# EAGLE design mk312 (EAGLE 6.6.0)

## Sheet 1 of 5: PSU
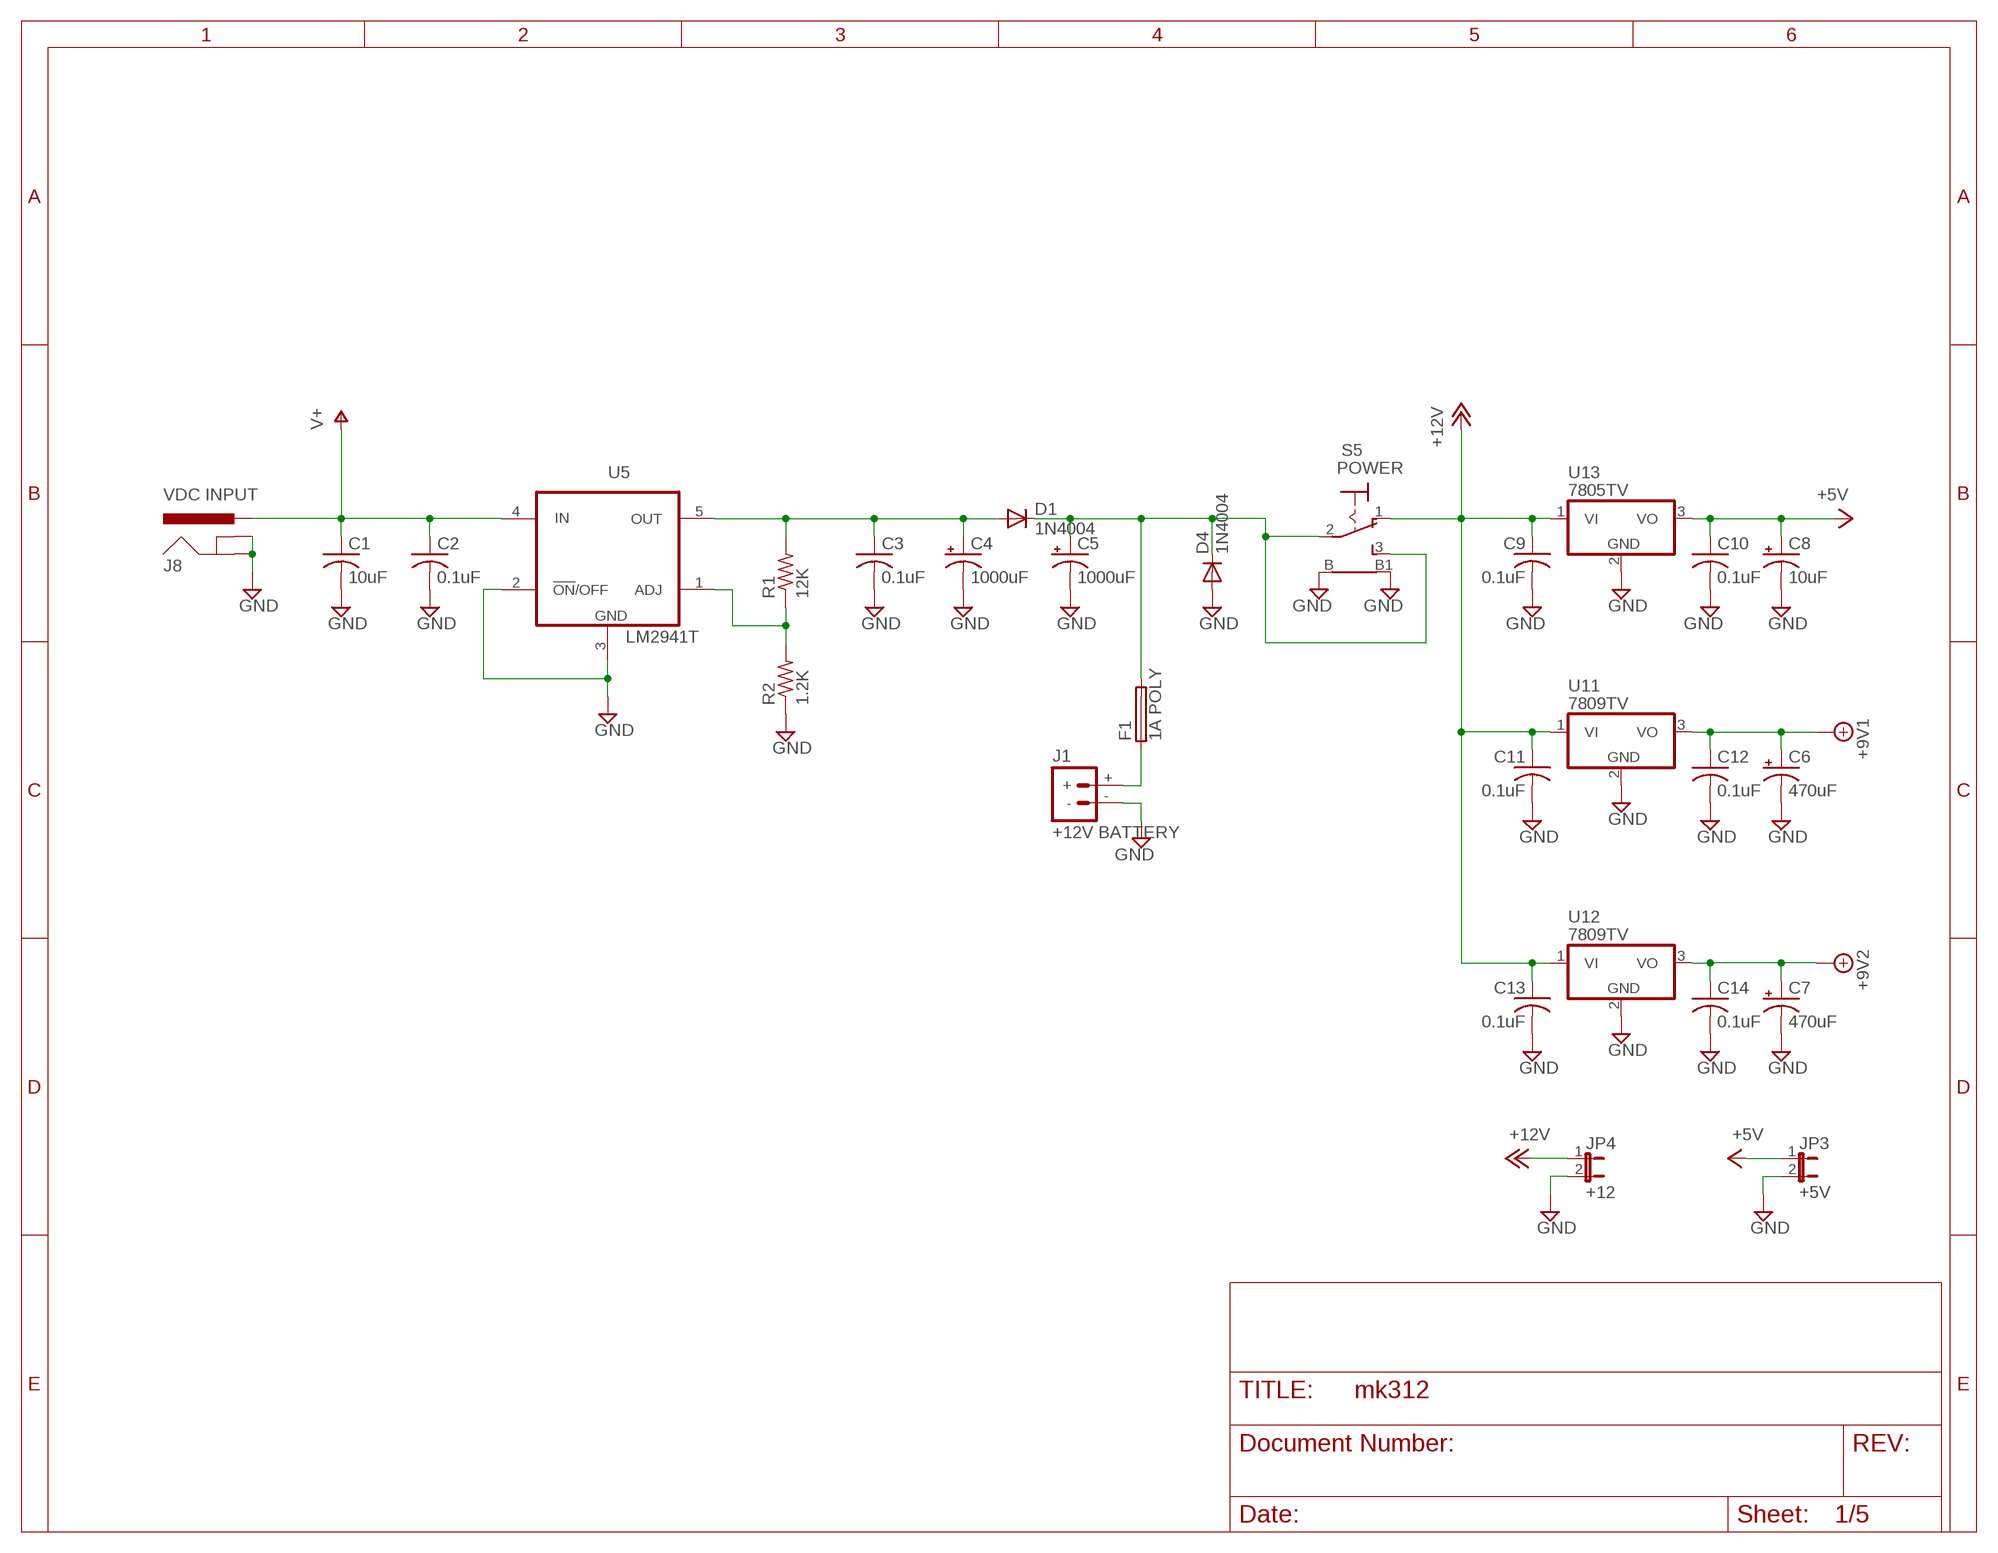
[diagram p0: schematic, sheet 1]

### Parts
C1  10uF  C-US050-024X044  [C050-024X044]
C2  0.1uF  C-US025-024X044  [C025-024X044]
C3  0.1uF  C-US025-024X044  [C025-024X044]
C4  1000uF  CPOL-USE5-10.5  [E5-10,5]
C5  1000uF  CPOL-USE5-10.5  [E5-10,5]
C6  470uF  CPOL-USE3.5-8  [E3,5-8]
C7  470uF  CPOL-USE3.5-8  [E3,5-8]
C8  10uF  CPOL-USE2.5-7  [E2,5-7]
C9  0.1uF  C-US025-024X044  [C025-024X044]
C10  0.1uF  C-US025-024X044  [C025-024X044]
C11  0.1uF  C-US025-024X044  [C025-024X044]
C12  0.1uF  C-US025-024X044  [C025-024X044]
C13  0.1uF  C-US025-024X044  [C025-024X044]
C14  0.1uF  C-US025-024X044  [C025-024X044]
D1  1N4004  [DO41-10]
D4  1N4004  [DO41-10]
F1  1A POLY  LITTLEFUSE  [LITTLEFUSE]
J1  +12V BATTERY  BATTERY_CONNDEANS  [DEANS]
J8  VDC INPUT  POWER_JACKSLT  [POWER_JACK_SLOT]
JP3  +5V  JP1E  [JP1]
JP4  +12  JP1E  [JP1]
R1  12K  R-US_0207/10  [0207/10]
R2  1.2K  R-US_0207/10  [0207/10]
S5  POWER  LPV-1  [LPV-1]
U5  LM2941T  [TO220-5]
U11  7809TV  7805TV  [TO220V]
U12  7809TV  7805TV  [TO220V]
U13  7805TV  [TO220V]

### Nets
+5V: C8.+ C10.1 JP3.1 U13.3(VO) ; also sheet 2,3,4,5
+8V: C6.+ C12.1 U11.3(VO) ; supply symbol labelled +9V1 ; also sheet 5
+9V: C7.+ C14.1 U12.3(VO) ; supply symbol labelled +9V2 ; also sheet 5
+12V: C9.1 C11.1 C13.1 JP4.1 S5.1(O) U11.1(VI) U12.1(VI) U13.1(VI) ; also sheet 2
GND: C1.2 C2.2 C3.2 C4.- C5.- C6.- C7.- C8.- C9.2 C10.2 C11.2 C12.2 C13.2 C14.2 D4.A J1.- J8.GND@1(GNDBREAK) J8.GND@2(GND) JP3.2 JP4.2 R2.1 S5.B S5.B1 U5.2(!ON!/OFF) U5.3(GND) U11.2(GND) U12.2(GND) U13.2(GND) ; also sheet 2,3,4,5
N$31: F1.1 J1.+
N$43: R1.1 R2.2 U5.1(ADJ)
N$45: C3.1 C4.+ D1.A R1.2 U5.5(OUT)
N$78: C5.+ D1.C D4.C F1.2 S5.2(P) S5.3(S)
V+: C1.1 C2.1 J8.PWR U5.4(IN) ; also sheet 2

## Sheet 2 of 5
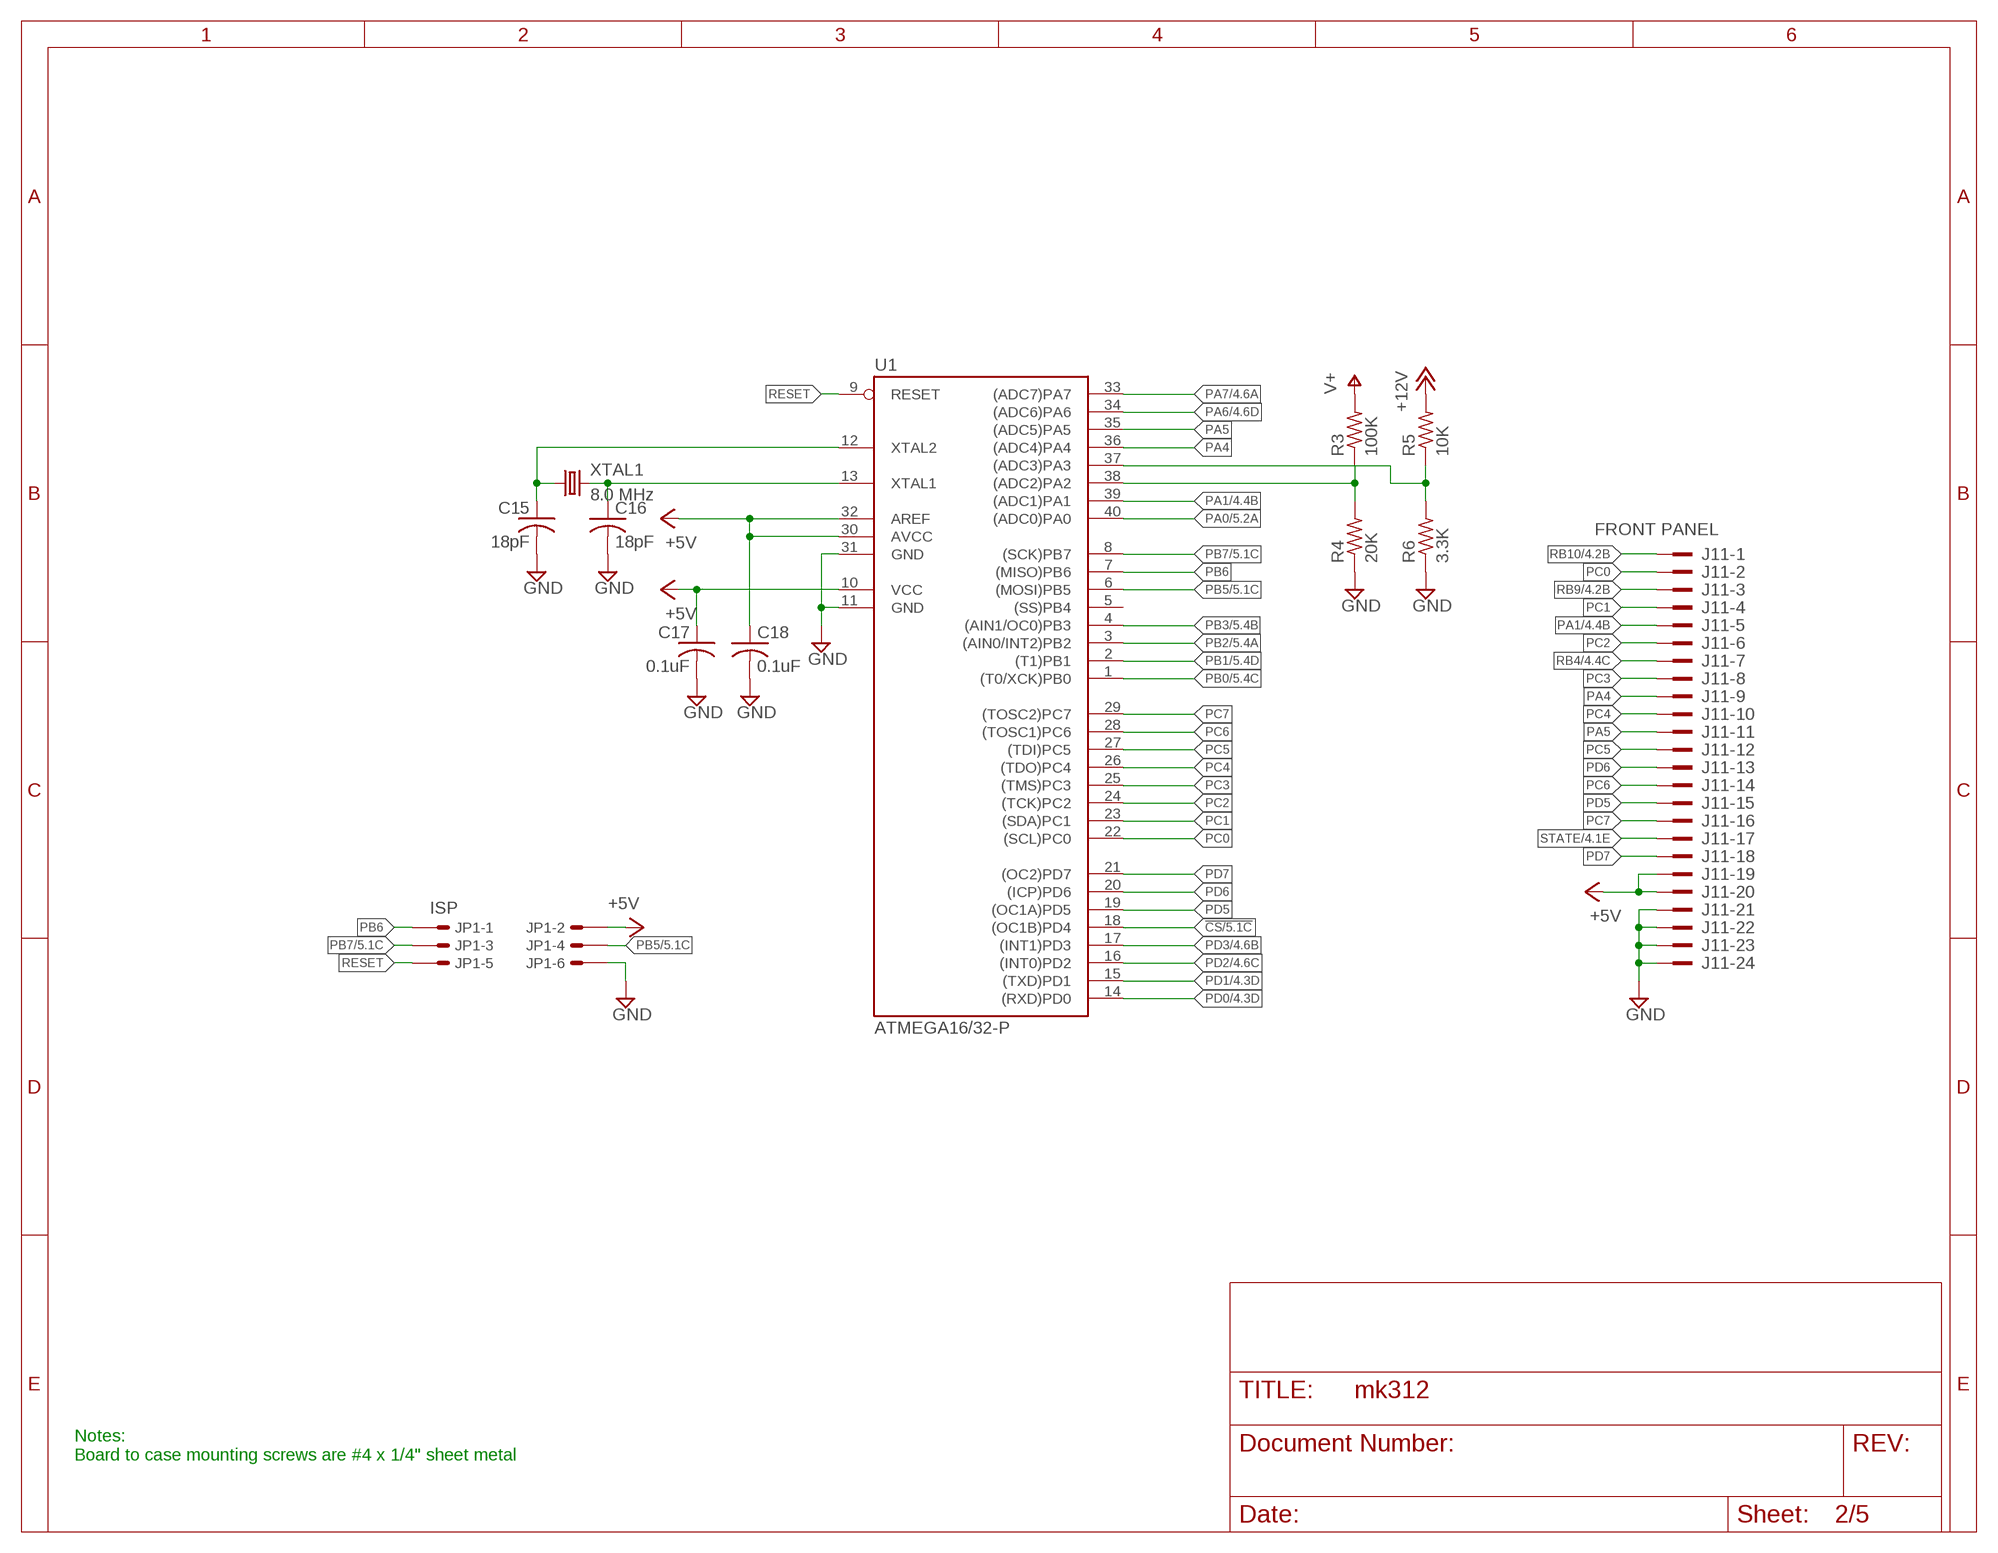
[diagram p1: schematic, sheet 2]

### Parts
C15  18pF  C-US025-024X044  [C025-024X044]
C16  18pF  C-US025-024X044  [C025-024X044]
C17  0.1uF  C-US025-024X044  [C025-024X044]
C18  0.1uF  C-US025-024X044  [C025-024X044]
J11  FRONT PANEL  2524-  [PAK100/2500-24]
JP1  ISP  057-006-1  [057-006-1]
R3  100K  R-US_0207/10  [0207/10]
R4  20K  R-US_0207/10  [0207/10]
R5  10K  R-US_0207/10  [0207/10]
R6  3.3K  R-US_0207/10  [0207/10]
U1  ATMEGA16/32-P  MEGA16-P  [DIL40]
XTAL1  8.0 MHz  CRYSTALHC49S  [HC49/S]

### Nets
!CS: U1.18((OC1B)PD4) ; also sheet 5
+5V: C17.1 C18.1 J11.19 J11.20 JP1.2 U1.10(VCC) U1.30(AVCC) U1.32(AREF) ; also sheet 1,3,4,5
+12V: R5.2 ; also sheet 1
GND: C15.2 C16.2 C17.2 C18.2 J11.21 J11.22 J11.23 J11.24 JP1.6 R4.1 R6.1 U1.11(GND) U1.31(GND) ; also sheet 1,3,4,5
N$2: R5.1 R6.2 U1.37((ADC3)PA3)
N$3: R3.1 R4.2 U1.38((ADC2)PA2)
N$17: C16.1 U1.13(XTAL1) XTAL1.2
N$32: C15.1 U1.12(XTAL2) XTAL1.1
PA0: U1.40((ADC0)PA0) ; also sheet 5
PA1: J11.5 U1.39((ADC1)PA1) ; also sheet 4
PA4: J11.9 U1.36((ADC4)PA4)
PA5: J11.11 U1.35((ADC5)PA5)
PA6: U1.34((ADC6)PA6) ; also sheet 4
PA7: U1.33((ADC7)PA7) ; also sheet 4
PB0: U1.1((T0/XCK)PB0) ; also sheet 5
PB1: U1.2((T1)PB1) ; also sheet 5
PB2: U1.3((AIN0/INT2)PB2) ; also sheet 5
PB3: U1.4((AIN1/OC0)PB3) ; also sheet 5
PB5: JP1.4 U1.6((MOSI)PB5) ; also sheet 5
PB6: JP1.1 U1.7((MISO)PB6)
PB7: JP1.3 U1.8((SCK)PB7) ; also sheet 5
PC0: J11.2 U1.22((SCL)PC0) ; also sheet 3
PC1: J11.4 U1.23((SDA)PC1) ; also sheet 3
PC2: J11.6 U1.24((TCK)PC2) ; also sheet 3
PC3: J11.8 U1.25((TMS)PC3) ; also sheet 3
PC4: J11.10 U1.26((TDO)PC4) ; also sheet 3
PC5: J11.12 U1.27((TDI)PC5) ; also sheet 3
PC6: J11.14 U1.28((TOSC1)PC6) ; also sheet 3
PC7: J11.16 U1.29((TOSC2)PC7) ; also sheet 3
PD0: U1.14((RXD)PD0) ; also sheet 4
PD1: U1.15((TXD)PD1) ; also sheet 4
PD2: U1.16((INT0)PD2) ; also sheet 4
PD3: U1.17((INT1)PD3) ; also sheet 4
PD5: J11.15 U1.19((OC1A)PD5) ; also sheet 3
PD6: J11.13 U1.20((ICP)PD6) ; also sheet 3
PD7: J11.18 U1.21((OC2)PD7) ; also sheet 3
RB4: J11.7 ; also sheet 4
RB9: J11.3 ; also sheet 4
RB10: J11.1 ; also sheet 4
RESET: JP1.5 U1.9(RESET)
STATE: J11.17 ; also sheet 4
V+: R3.2 ; also sheet 1
Unconnected: U1.5((SS)PB4)

### Notes on the sheet
- Notes:
  Board to case mounting screws are #4 x 1/4" sheet metal

## Sheet 3 of 5: Small PCB
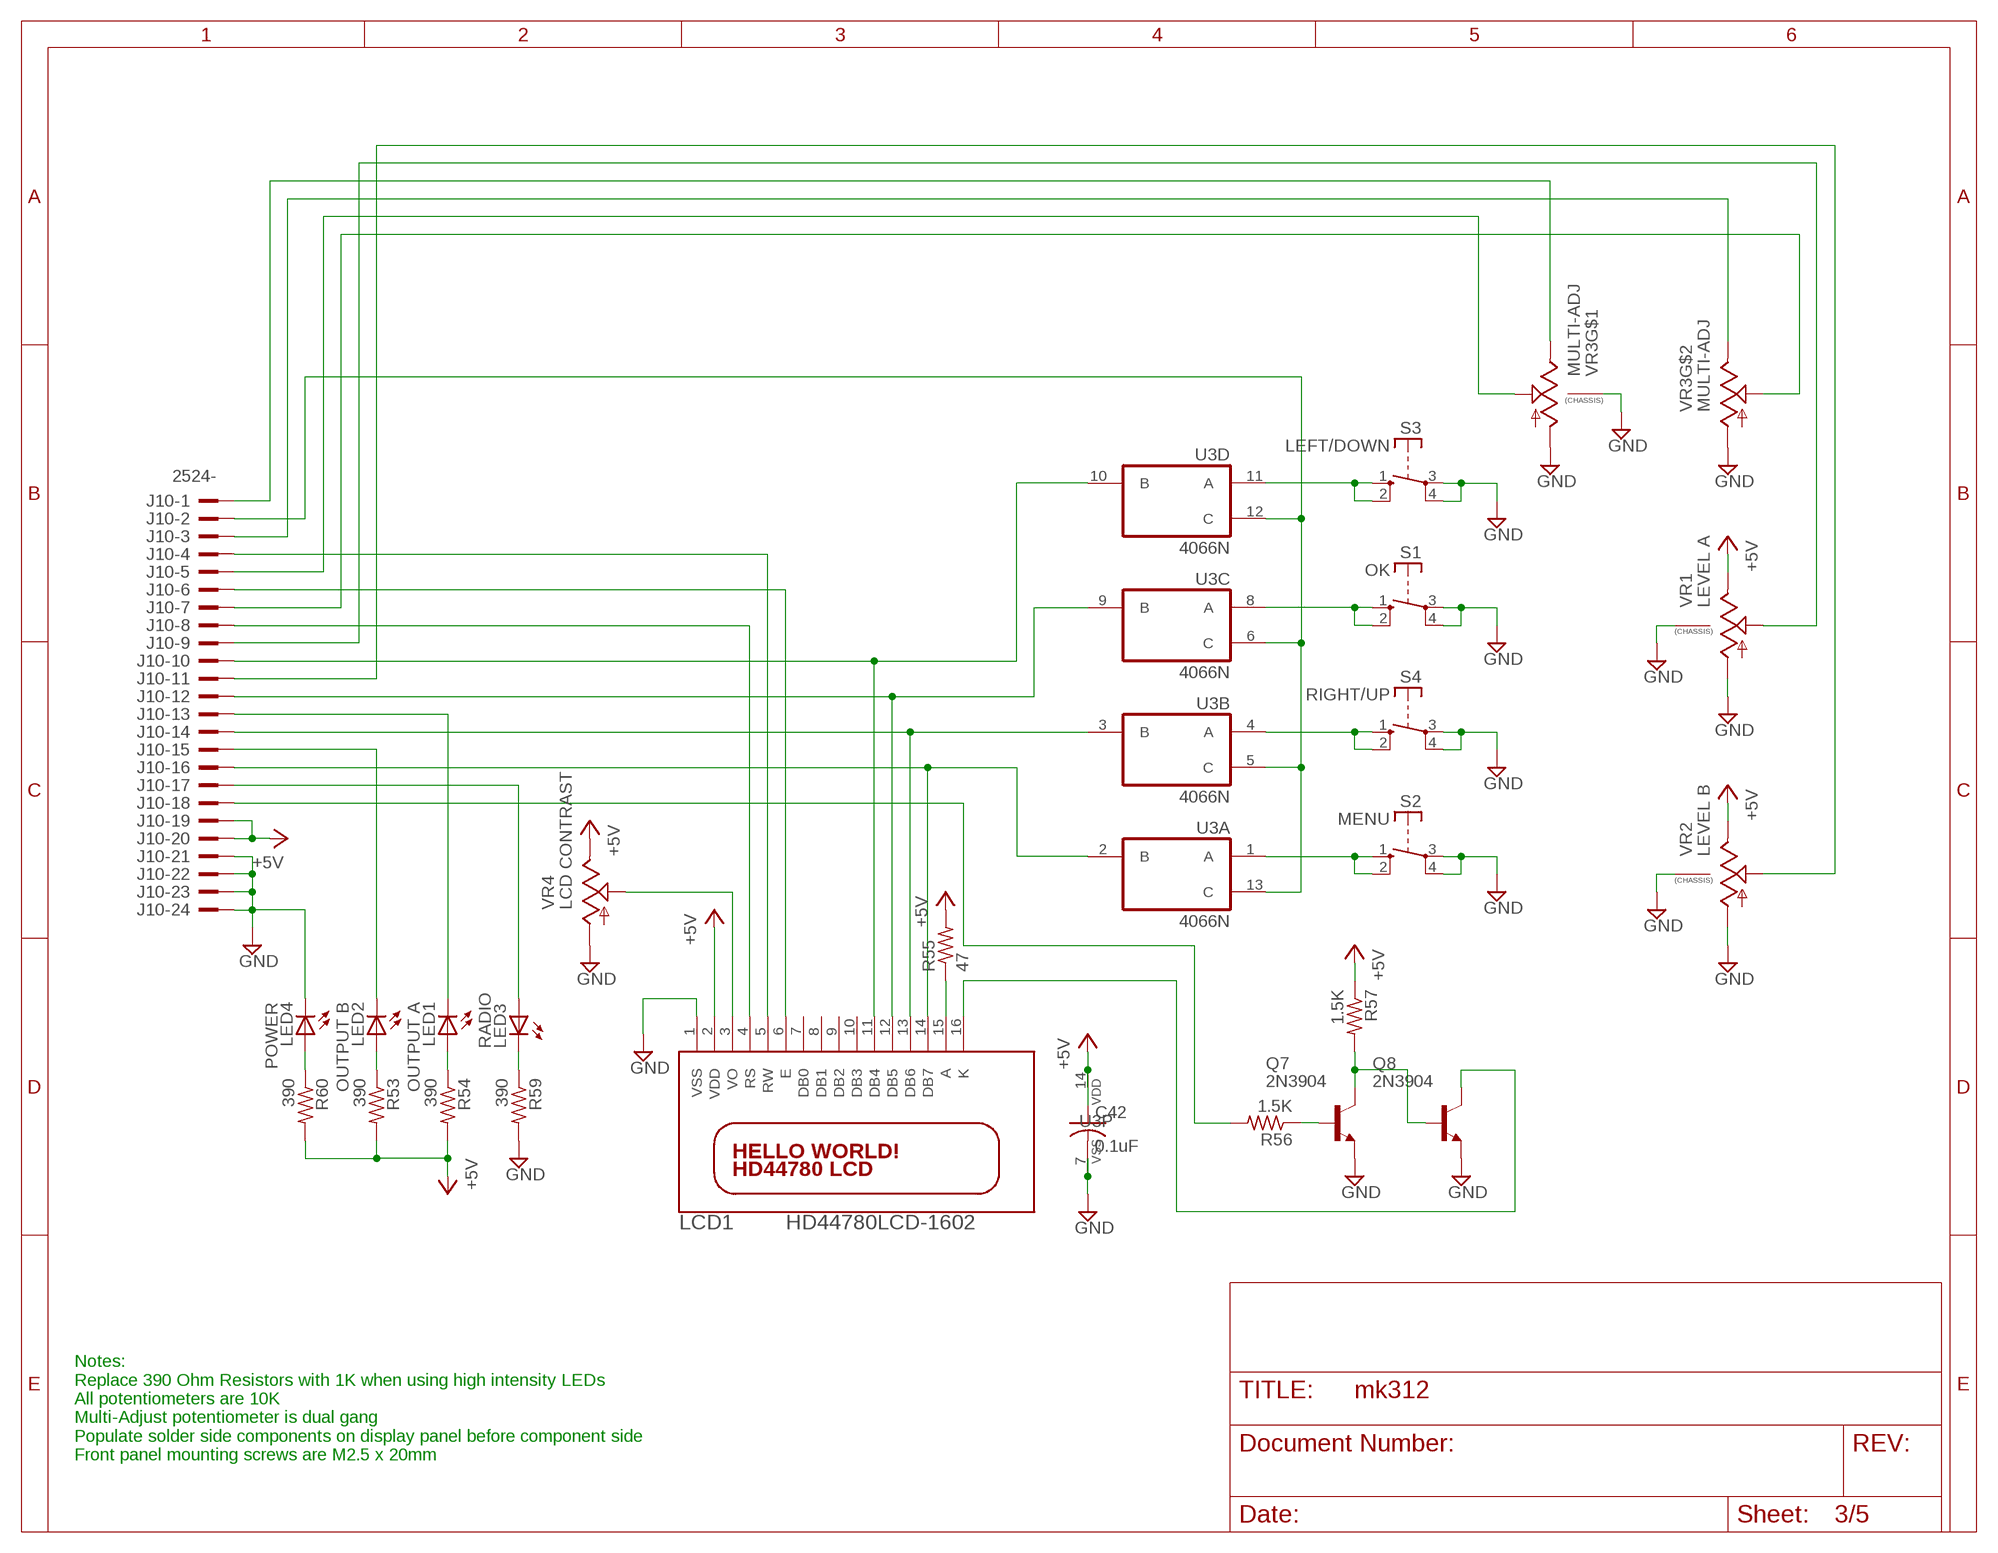
[diagram p2: schematic, sheet 3]

### Parts
C42  0.1uF  C-US025-024X044  [C025-024X044]
J10  2524-  [PAK100/2500-24]
LCD1  HD44780LCD-1602  [LCD1602]
LED1  OUTPUT A  LED5MM  [LED5MM]
LED2  OUTPUT B  LED5MM  [LED5MM]
LED3  RADIO  LED5MM  [LED5MM]
LED4  POWER  LED5MM  [LED5MM]
Q7  2N3904  [TO92]
Q8  2N3904  [TO92]
R53  390  R-US_0207/10  [0207/10]
R54  390  R-US_0207/10  [0207/10]
R55  47  R-US_0207/10  [0207/10]
R56  1.5K  R-US_0207/10  [0207/10]
R57  1.5K  R-US_0207/10  [0207/10]
R59  390  R-US_0207/10  [0207/10]
R60  390  R-US_0207/10  [0207/10]
S1  OK  DTE6K  [DTE6K]
S2  MENU  DTE6K  [DTE6K]
S3  LEFT/DOWN  DTE6K  [DTE6K]
S4  RIGHT/UP  DTE6K  [DTE6K]
U3  4066N  [DIL14]
VR1  LEVEL A  9MM_SNAP-IN_POT_CHASSIS  [9MM_SNAP-IN_POT]
VR2  LEVEL B  9MM_SNAP-IN_POT_CHASSIS  [9MM_SNAP-IN_POT]
VR3  MULTI-ADJ  ALPHA-9MM-DUALPOT  [DUAL_9MM_SNAP-IN_POT]
VR4  LCD CONTRAST  TRIM_US-B25P  [B25P]

### Nets
+5V: C42.1 J10.19 J10.20 LCD1.2(VDD) R53.2 R54.2 R55.2 R57.1 R60.2 U3.14(P:VDD) VR1.3(E) VR2.3(E) VR4.E ; also sheet 1,2,4,5
GND: C42.2 J10.21 J10.22 J10.23 J10.24 LCD1.1(VSS) LED4.K(C) Q7.3(E) Q8.3(E) R59.2 S1.3(P) S1.4(P) S2.3(P) S2.4(P) S3.3(P) S3.4(P) S4.3(P) S4.4(P) U3.7(P:VSS) VR1.1(A) VR1.CHASSIS2 VR2.1(A) VR2.CHASSIS2 VR3.1(A) VR3.1B(A) VR3.CHASSIS1 VR3.CHASSIS2 VR4.A ; also sheet 1,2,4,5
N$1: J10.7 VR3.2B(S)
N$4: S1.1(S) S1.2(S) U3.8(C:A)
N$5: S3.1(S) S3.2(S) U3.11(D:A)
N$7: S4.1(S) S4.2(S) U3.4(B:A)
N$10: J10.3 VR3.3B(E)
N$11: J10.9 VR1.2(S)
N$12: J10.11 VR2.2(S)
N$13: J10.1 VR3.3(E)
N$15: J10.5 VR3.2(S)
N$23: LED2.A R53.1
N$29: LED1.A R54.1
N$30: LCD1.3(VO) VR4.S
N$47: LCD1.15(A) R55.1
N$79: LED3.K(C) R59.1
N$80: S2.1(S) S2.2(S) U3.1(A:A)
N$81: LED4.A R60.1
N$82: Q7.2(B) R56.1
N$83: Q7.1(C) Q8.2(B) R57.2
N$84: LCD1.16(K) Q8.1(C)
N$86: J10.17 LED3.A
PC0: J10.2 U3.5(B:C) U3.6(C:C) U3.12(D:C) U3.13(A:C) ; also sheet 2
PC1: J10.4 LCD1.5(RW) ; also sheet 2
PC2: J10.6 LCD1.6(E) ; also sheet 2
PC3: J10.8 LCD1.4(RS) ; also sheet 2
PC4: J10.10 LCD1.11(DB4) U3.10(D:B) ; also sheet 2
PC5: J10.12 LCD1.12(DB5) U3.9(C:B) ; also sheet 2
PC6: J10.14 LCD1.13(DB6) U3.3(B:B) ; also sheet 2
PC7: J10.16 LCD1.14(DB7) U3.2(A:B) ; also sheet 2
PD5: J10.15 LED2.K(C) ; also sheet 2
PD6: J10.13 LED1.K(C) ; also sheet 2
PD7: J10.18 R56.2 ; also sheet 2
Unconnected: LCD1.7(DB0) LCD1.8(DB1) LCD1.9(DB2) LCD1.10(DB3)

### Notes on the sheet
- Notes:
  Replace 390 Ohm Resistors with 1K when using high intensity LEDs
  All potentiometers are 10K
  Multi-Adjust potentiometer is dual gang
  Populate solder side components on display panel before component side
  Front panel mounting screws are M2.5 x 20mm

## Sheet 4 of 5: Input stage
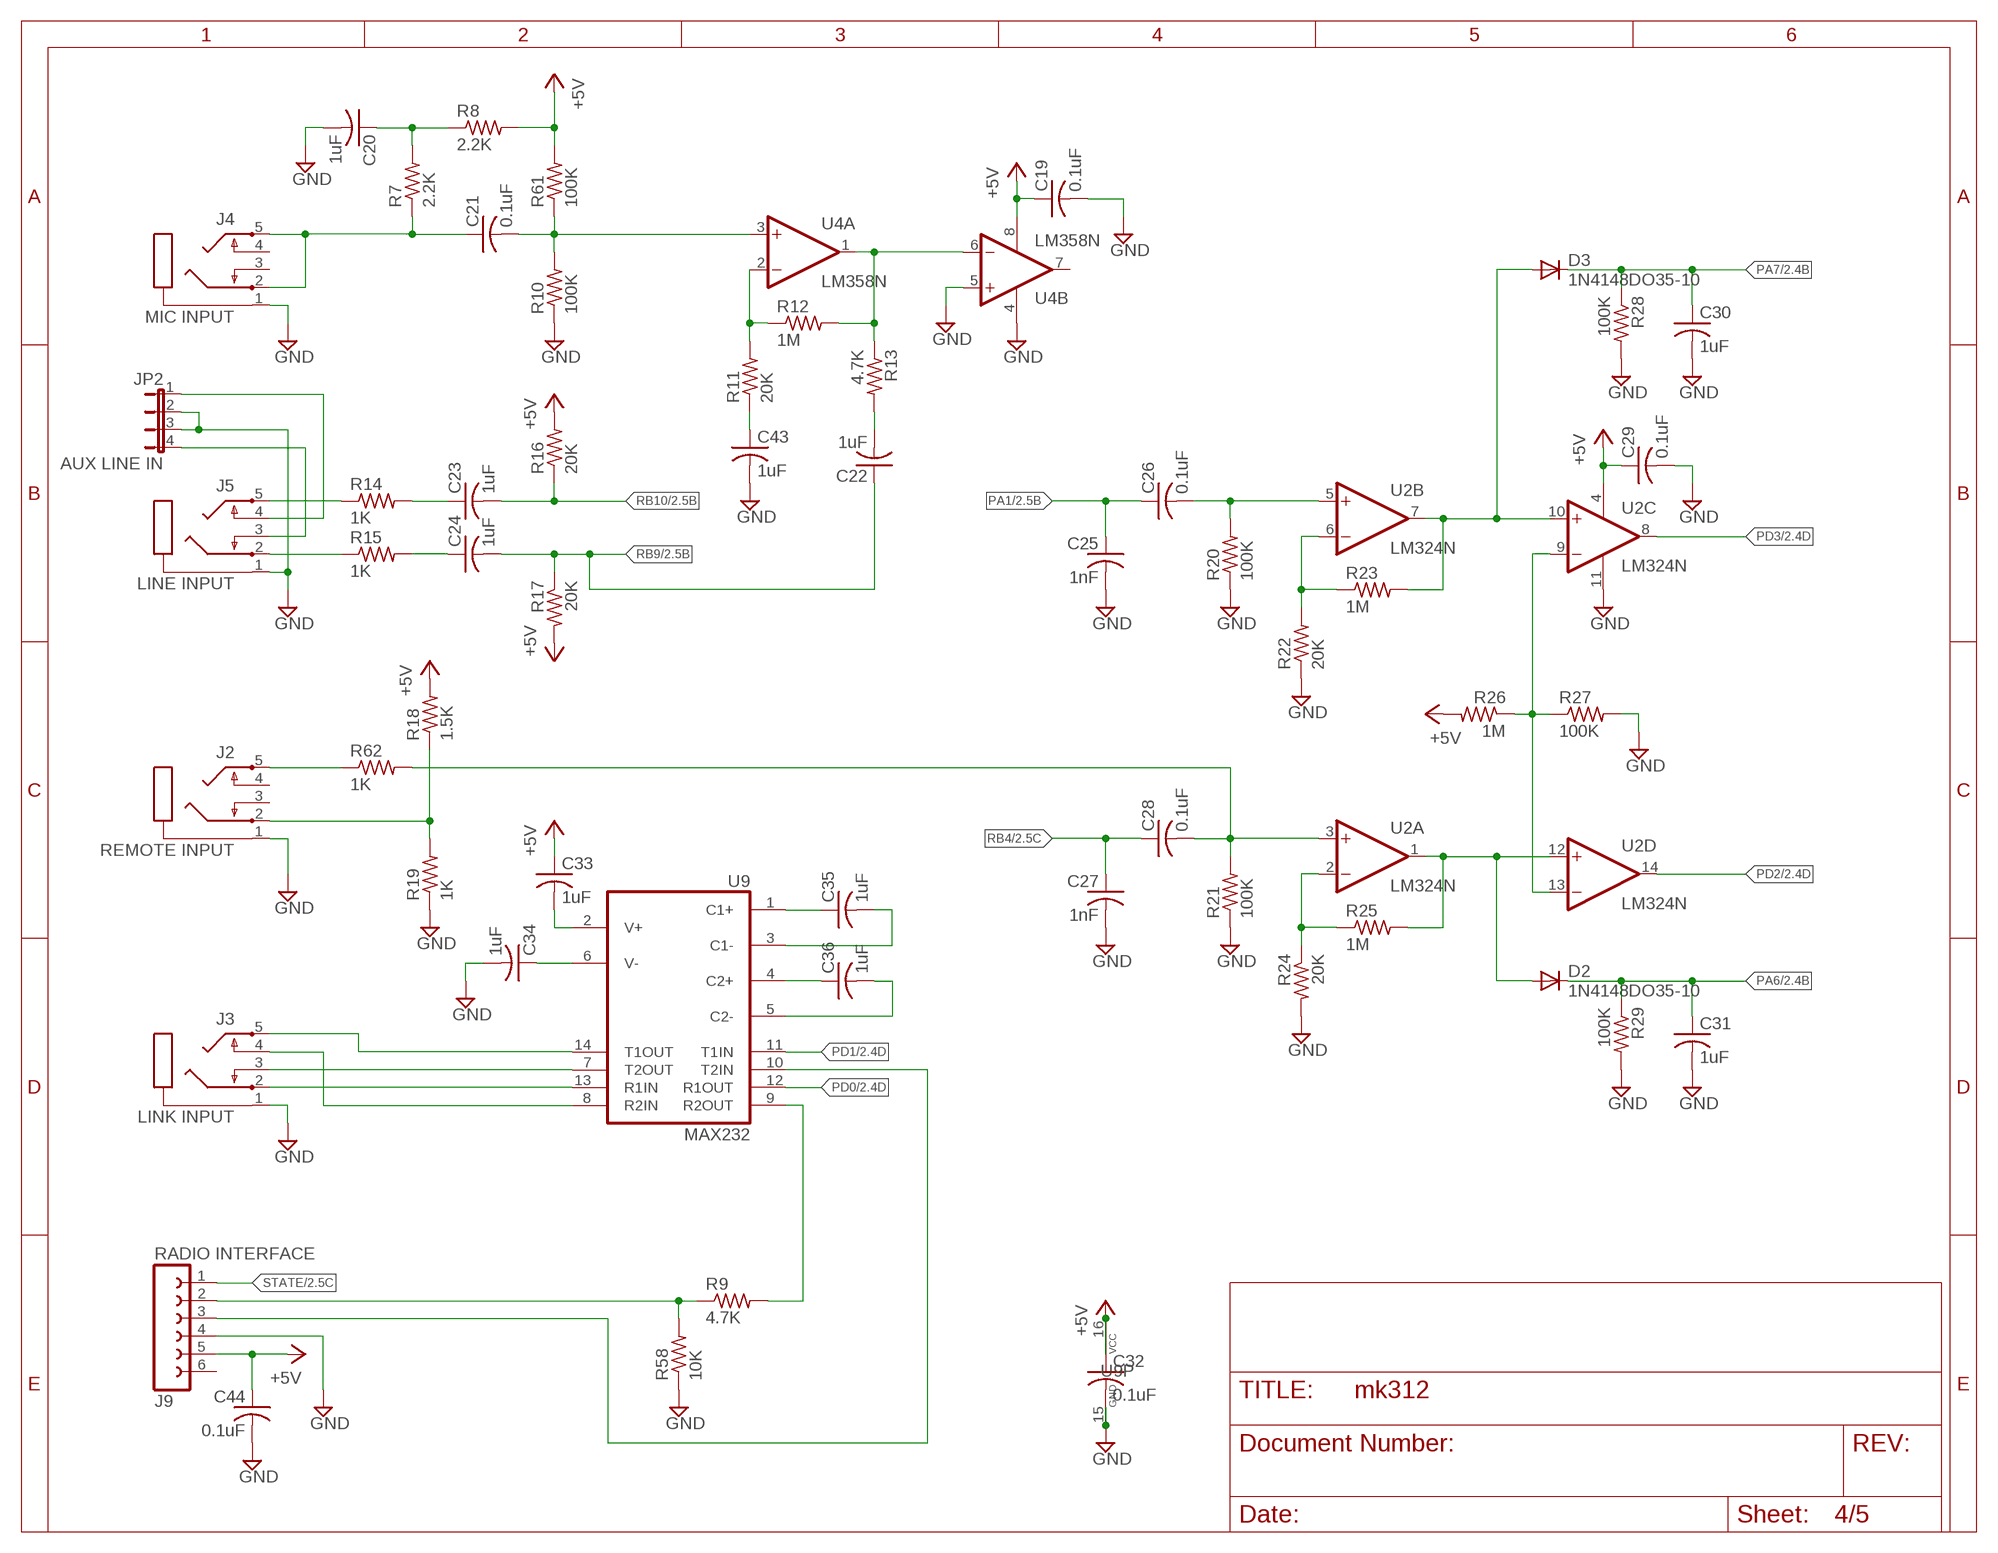
[diagram p3: schematic, sheet 4]

### Parts
C19  0.1uF  C-US025-024X044  [C025-024X044]
C20  1uF  C-US025-024X044  [C025-024X044]
C21  0.1uF  C-US025-024X044  [C025-024X044]
C22  1uF  C-US025-024X044  [C025-024X044]
C23  1uF  C-US025-024X044  [C025-024X044]
C24  1uF  C-US025-024X044  [C025-024X044]
C25  1nF  C-US025-024X044  [C025-024X044]
C26  0.1uF  C-US025-024X044  [C025-024X044]
C27  1nF  C-US025-024X044  [C025-024X044]
C28  0.1uF  C-US025-024X044  [C025-024X044]
C29  0.1uF  C-US025-024X044  [C025-024X044]
C30  1uF  C-US025-024X044  [C025-024X044]
C31  1uF  C-US025-024X044  [C025-024X044]
C32  0.1uF  C-US025-024X044  [C025-024X044]
C33  1uF  C-US025-024X044  [C025-024X044]
C34  1uF  C-US025-024X044  [C025-024X044]
C35  1uF  C-US025-024X044  [C025-024X044]
C36  1uF  C-US025-024X044  [C025-024X044]
C43  1uF  C-US025-024X044  [C025-024X044]
C44  0.1uF  C-US025-024X044  [C025-024X044]
D2  1N4148DO35-10  [DO35-10]
D3  1N4148DO35-10  [DO35-10]
J2  REMOTE INPUT  STEREOJACK  [STX3100]
J3  LINK INPUT  STEREOJACK  [STX3100]
J4  MIC INPUT  STEREOJACK  [STX3100]
J5  LINE INPUT  STEREOJACK  [STX3100]
J9  RADIO INTERFACE  FE06-1  [FE06]
JP2  AUX LINE IN  JP4E  [JP4]
R7  2.2K  R-US_0207/10  [0207/10]
R8  2.2K  R-US_0207/10  [0207/10]
R9  4.7K  R-US_0207/10  [0207/10]
R10  100K  R-US_0207/10  [0207/10]
R11  20K  R-US_0207/10  [0207/10]
R12  1M  R-US_0207/10  [0207/10]
R13  4.7K  R-US_0207/10  [0207/10]
R14  1K  R-US_0207/10  [0207/10]
R15  1K  R-US_0207/10  [0207/10]
R16  20K  R-US_0207/10  [0207/10]
R17  20K  R-US_0207/10  [0207/10]
R18  1.5K  R-US_0207/10  [0207/10]
R19  1K  R-US_0207/10  [0207/10]
R20  100K  R-US_0207/10  [0207/10]
R21  100K  R-US_0207/10  [0207/10]
R22  20K  R-US_0207/10  [0207/10]
R23  1M  R-US_0207/10  [0207/10]
R24  20K  R-US_0207/10  [0207/10]
R25  1M  R-US_0207/10  [0207/10]
R26  1M  R-US_0207/10  [0207/10]
R27  100K  R-US_0207/10  [0207/10]
R28  100K  R-US_0207/10  [0207/10]
R29  100K  R-US_0207/10  [0207/10]
R58  10K  R-US_0207/10  [0207/10]
R61  100K  R-US_0207/10  [0207/10]
R62  1K  R-US_0207/10  [0207/10]
U2  LM324N  [DIL14]
U4  LM358N  [DIL08]
U9  MAX232  [DIL16]

### Nets
+5V: C19.1 C29.1 C32.1 C33.1 C44.1 J9.5 R8.2 R16.2 R17.2 R18.2 R26.2 R61.2 U2.4(P:V+) U4.8(P:V+) U9.16(VCC) ; also sheet 1,2,3,5
GND: C19.2 C20.2 C25.2 C27.2 C29.2 C30.2 C31.2 C32.2 C34.2 C43.2 C44.2 J2.1 J3.1 J4.1 J5.1 J9.4 JP2.2 JP2.3 R10.1 R19.1 R20.1 R21.1 R22.1 R24.2 R27.2 R28.2 R29.2 R58.1 U2.11(P:V-) U4.4(P:V-) U4.5(B:+IN) U9.15(GND) ; also sheet 1,2,3,5
N$14: C28.2 R21.2 R62.2 U2.3(A:+IN)
N$33: R9.2 U9.9(R2OUT)
N$44: J3.5 U9.14(T1OUT)
N$46: J3.2 U9.13(R1IN)
N$49: C43.1 R11.1
N$50: J2.5 R62.1
N$52: C35.1 U9.1(C1+)
N$53: R24.1 R25.1 U2.2(A:-IN)
N$54: D2.A R25.2 U2.1(A:OUT) U2.12(D:+IN)
N$55: J5.2 R15.1
N$56: J5.5 R14.1
N$57: C23.1 R14.2
N$58: J2.2 R18.1 R19.2
N$59: J5.4 JP2.1
N$60: R22.2 R23.1 U2.6(B:-IN)
N$61: C35.2 U9.3(C1-)
N$62: R26.1 R27.1 U2.9(C:-IN) U2.13(D:-IN)
N$63: C26.2 R20.2 U2.5(B:+IN)
N$64: J5.3 JP2.4
N$65: C24.1 R15.2
N$66: C36.2 U9.5(C2-)
N$67: C36.1 U9.4(C2+)
N$68: J9.2 R9.1 R58.2
N$69: D3.A R23.2 U2.7(B:OUT) U2.10(C:+IN)
N$70: C34.1 U9.6(V-)
N$71: C21.1 J4.2 J4.5 R7.1
N$72: C20.1 R7.2 R8.1
N$73: C21.2 R10.2 R61.1 U4.3(A:+IN)
N$74: R11.2 R12.1 U4.2(A:-IN)
N$75: R12.2 R13.1 U4.1(A:OUT) U4.6(B:-IN)
N$76: C22.2 R13.2
N$77: C33.2 U9.2(V+)
N$87: J3.4 U9.8(R2IN)
N$88: J3.3 U9.7(T2OUT)
N$89: J9.3 U9.10(T2IN)
PA1: C25.1 C26.1 ; also sheet 2
PA6: C31.1 D2.C R29.1 ; also sheet 2
PA7: C30.1 D3.C R28.1 ; also sheet 2
PD0: U9.12(R1OUT) ; also sheet 2
PD1: U9.11(T1IN) ; also sheet 2
PD2: U2.14(D:OUT) ; also sheet 2
PD3: U2.8(C:OUT) ; also sheet 2
RB4: C27.1 C28.1 ; also sheet 2
RB9: C22.1 C24.2 R17.1 ; also sheet 2
RB10: C23.2 R16.1 ; also sheet 2
STATE: J9.1 ; also sheet 2
Unconnected: J2.3 J2.4 J4.3 J4.4 J9.6 U4.7(B:OUT)

## Sheet 5 of 5: Output stage
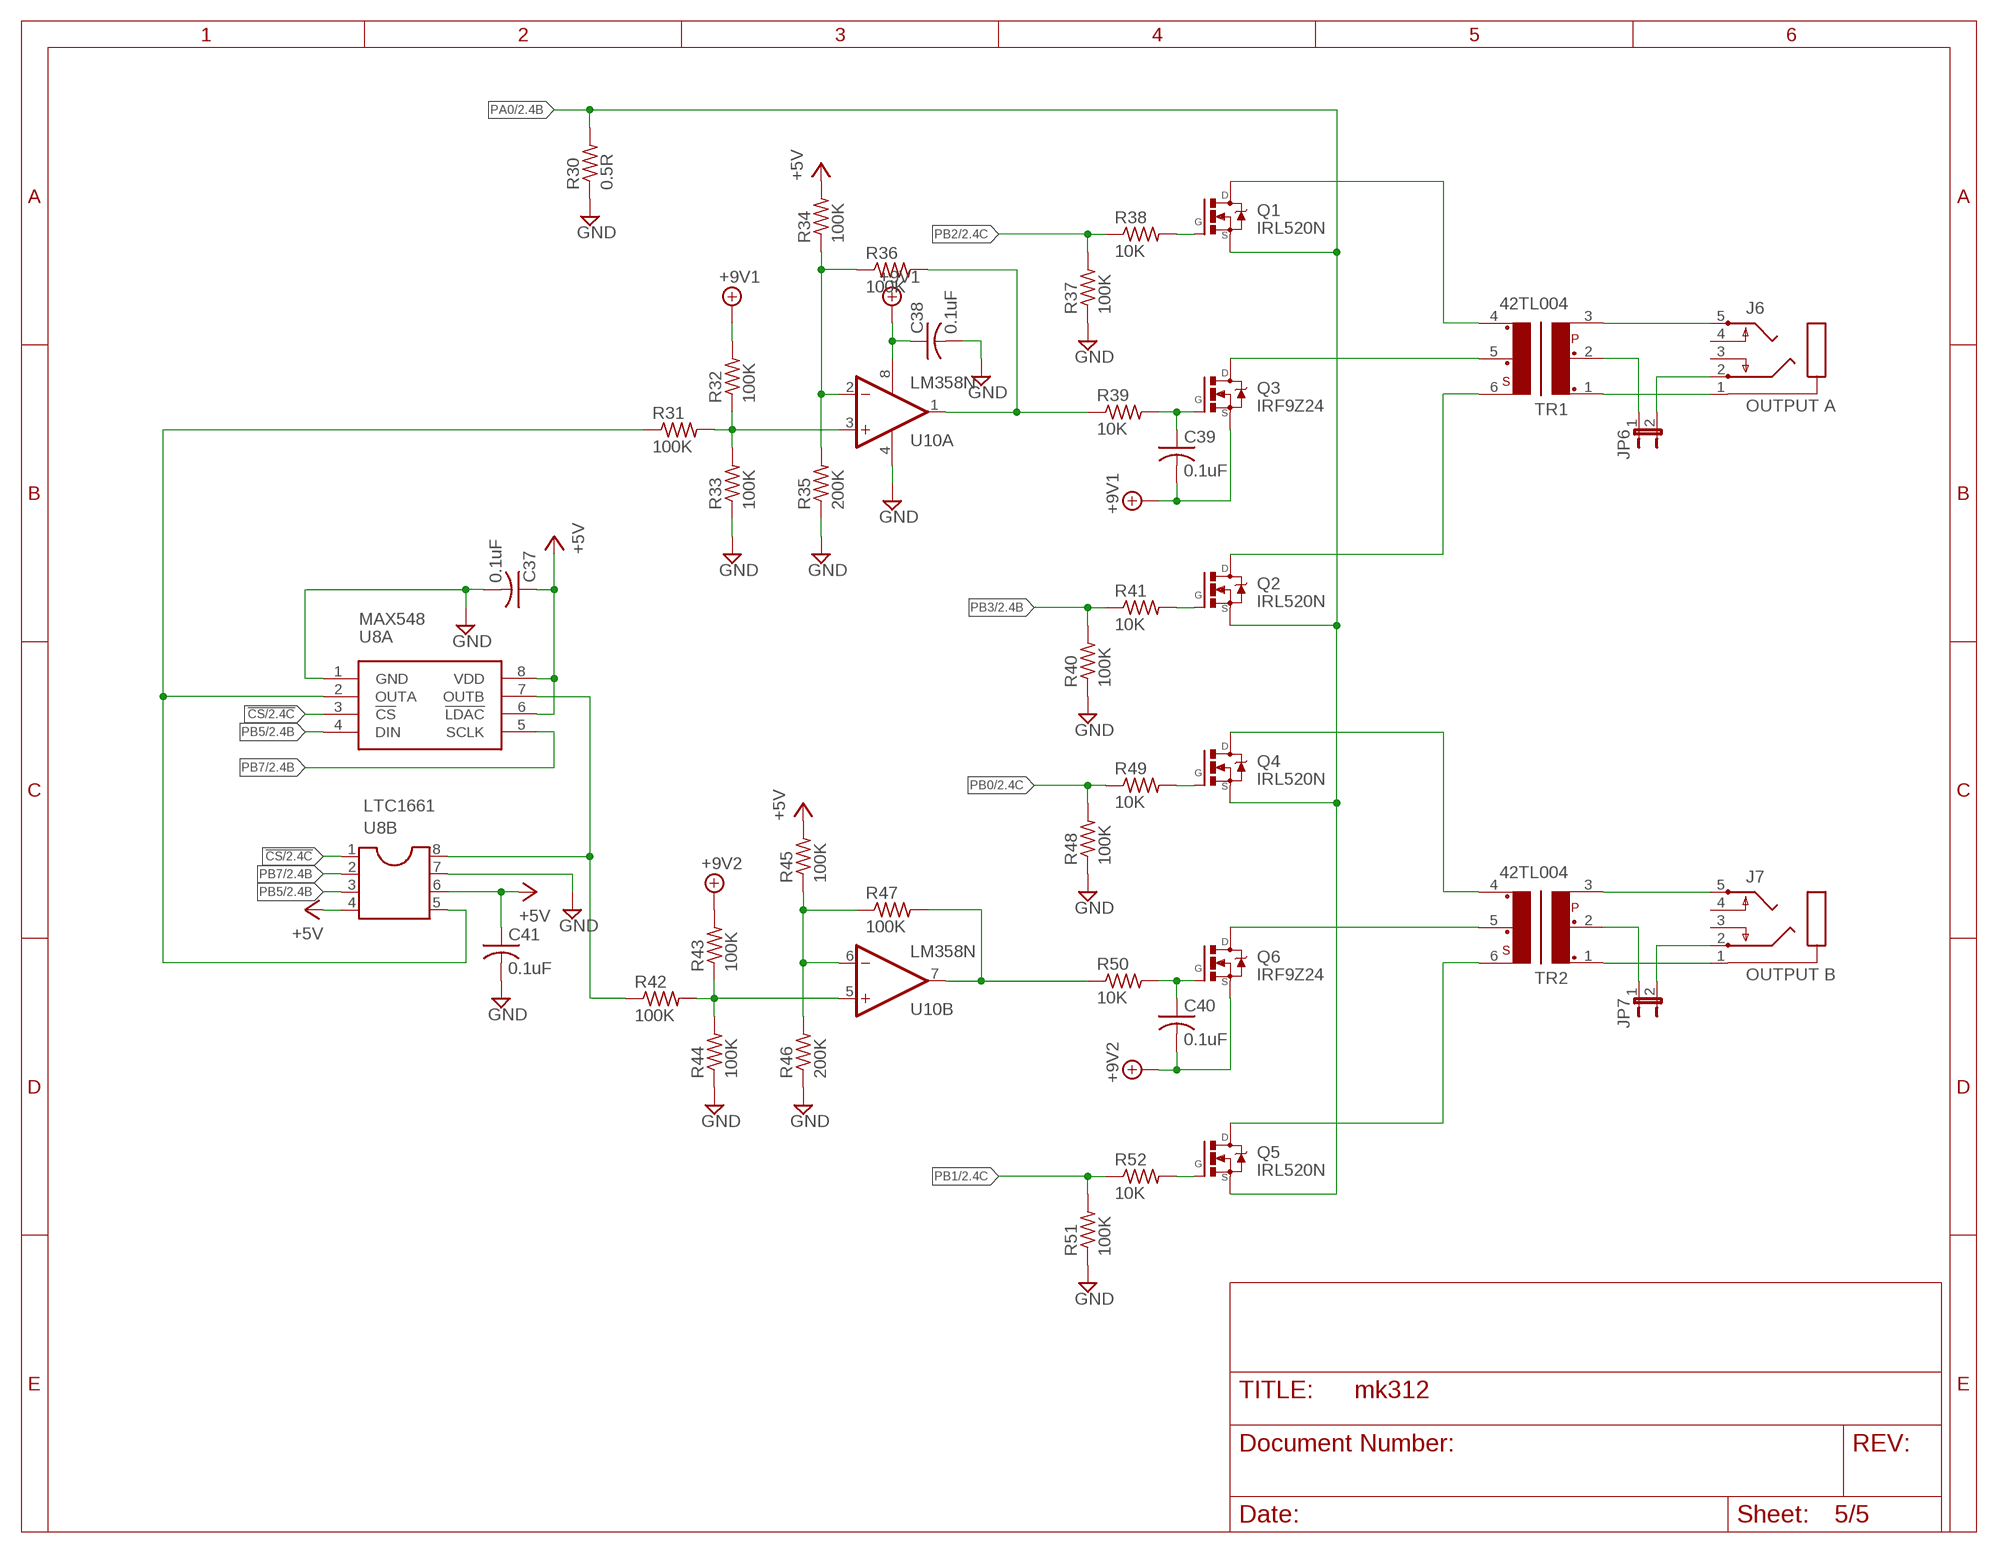
[diagram p4: schematic, sheet 5]

### Parts
C37  0.1uF  C-US025-024X044  [C025-024X044]
C38  0.1uF  C-US025-024X044  [C025-024X044]
C39  0.1uF  C-US025-024X044  [C025-024X044]
C40  0.1uF  C-US025-024X044  [C025-024X044]
C41  0.1uF  C-US025-024X044  [C025-024X044]
J6  OUTPUT A  STEREOJACK  [STX3100]
J7  OUTPUT B  STEREOJACK  [STX3100]
JP6  JP1E  [JP1]
JP7  JP1E  [JP1]
Q1  IRL520N  IRL530N-V  [TO220V]
Q2  IRL520N  IRL530N-V  [TO220V]
Q3  IRF9Z24  IRL530N-V  [TO220V]
Q4  IRL520N  IRL530N-V  [TO220V]
Q5  IRL520N  IRL530N-V  [TO220V]
Q6  IRF9Z24  IRL530N-V  [TO220V]
R30  0.5R  R-US_0309/12  [0309/12]
R31  100K  R-US_0207/10  [0207/10]
R32  100K  R-US_0207/10  [0207/10]
R33  100K  R-US_0207/10  [0207/10]
R34  100K  R-US_0207/10  [0207/10]
R35  200K  R-US_0207/10  [0207/10]
R36  100K  R-US_0207/10  [0207/10]
R37  100K  R-US_0207/10  [0207/10]
R38  10K  R-US_0207/10  [0207/10]
R39  10K  R-US_0207/10  [0207/10]
R40  100K  R-US_0207/10  [0207/10]
R41  10K  R-US_0207/10  [0207/10]
R42  100K  R-US_0207/10  [0207/10]
R43  100K  R-US_0207/10  [0207/10]
R44  100K  R-US_0207/10  [0207/10]
R45  100K  R-US_0207/10  [0207/10]
R46  200K  R-US_0207/10  [0207/10]
R47  100K  R-US_0207/10  [0207/10]
R48  100K  R-US_0207/10  [0207/10]
R49  10K  R-US_0207/10  [0207/10]
R50  10K  R-US_0207/10  [0207/10]
R51  100K  R-US_0207/10  [0207/10]
R52  10K  R-US_0207/10  [0207/10]
TR1  42TL004  42TL023  [42TL]
TR2  42TL004  42TL023  [42TL]
U8A  MAX548  [DIL08]
U8B  LTC1661  DIL8S  [SOCKET-08]
U10  LM358N  [DIL08]

### Nets
!CS: U8A.3(!CS) U8B.1 ; also sheet 2
+5V: C37.1 C41.1 R34.2 R45.2 U8A.6(!LDAC) U8A.8(VDD) U8B.4 U8B.6 ; also sheet 1,2,3,4
+8V: C38.1 C39.2 Q3.3(S) R32.2 U10.8(P:V+) ; supply symbol labelled +9V1 ; also sheet 1
+9V: C40.2 Q6.3(S) R43.2 ; supply symbol labelled +9V2 ; also sheet 1
GND: C37.2 C38.2 C41.2 R30.1 R33.1 R35.1 R37.1 R40.1 R44.1 R46.1 R48.1 R51.1 U8A.1(GND) U8B.7 U10.4(P:V-) ; also sheet 1,2,3,4
N$6: Q3.2(D) TR1.5
N$8: Q6.2(D) TR2.5
N$9: JP7.1 TR2.2
N$16: J6.1 TR1.1
N$18: Q1.1(G) R38.2
N$19: Q2.1(G) R41.2
N$20: J7.2 JP7.2
N$21: C39.1 Q3.1(G) R39.2
N$22: R31.2 R32.1 R33.2 U10.3(A:+IN)
N$24: Q4.1(G) R49.2
N$25: Q5.1(G) R52.2
N$26: J7.1 TR2.1
N$27: C40.1 Q6.1(G) R50.2
N$28: R42.2 R43.1 R44.2 U10.5(B:+IN)
N$34: Q1.2(D) TR1.4
N$35: J6.5 TR1.3
N$36: Q4.2(D) TR2.4
N$37: J7.5 TR2.3
N$38: Q5.2(D) TR2.6
N$39: Q2.2(D) TR1.6
N$40: R34.1 R35.2 R36.1 U10.2(A:-IN)
N$41: R45.1 R46.2 R47.1 U10.6(B:-IN)
N$42: R31.1 U8A.2(OUTA) U8B.5
N$48: J6.2 JP6.2
N$51: JP6.1 TR1.2
N$85: R42.1 U8A.7(OUTB) U8B.8
PA0: Q1.3(S) Q2.3(S) Q4.3(S) Q5.3(S) R30.2 ; also sheet 2
PB0: R48.2 R49.1 ; also sheet 2
PB1: R51.2 R52.1 ; also sheet 2
PB2: R37.2 R38.1 ; also sheet 2
PB3: R40.2 R41.1 ; also sheet 2
PB5: U8A.4(DIN) U8B.3 ; also sheet 2
PB7: U8A.5(SCLK) U8B.2 ; also sheet 2
PFET_A: R36.2 R39.1 U10.1(A:OUT)
PFET_B: R47.2 R50.1 U10.7(B:OUT)
Unconnected: J6.3 J6.4 J7.3 J7.4

## Library data of the parts
C1-C3 C9-C44 = rcl:C-US: CAPACITOR, American symbol
C4-C8 = rcl:CPOL-US: POLARIZED CAPACITOR, American symbol
D1 D4 = diode:1N4004: DIODE general purpose rectifier, 1 A
D2 D3 = diode:1N4148: DIODE high speed (Philips)
F1 = fuse:LITTLEFUSE: LITTLEFUSE Picofuse/slow Littlefuse; OC_FARNELL: unknown; OC_NEWARK: unknown
J1 = SparkFun-Connectors:BATTERY_CONN: Various footprints for battery connectors
J2-J7 = adafruit:STEREOJACK: MIC/HEADPHONE JACK Stereo jack with two switches. Kycon STX3100, CUI SJ1-3555NG and/or 4UCon 05544
J8 = SparkFun-Connectors:POWER_JACK: Power Jack This is the standard 5.5mm barrel jack for power. The PTH is the most common, proven, reliable, footprint. The Slot footprint only works if the mill layer is transmitted to the PCB fab house so be warned. Mating wall wart : TOL-00298 (and others); PROD_ID: PRT-00119
J9 = con-lsta:FE06-1: FEMALE HEADER; OC_FARNELL: unknown; OC_NEWARK: unknown
J10 J11 = con-3m:2524-: 3M (TM) Pak 100 4-Wall Header Source: 3M; OC_FARNELL: unknown; OC_NEWARK: unknown
JP1 = con-panduit:057-006-: CONNECTOR 6-pin series 057 contact pc board low profile headers; OC_FARNELL: unknown; OC_NEWARK: unknown
JP2 = jumper:JP4E: JUMPER
JP3 JP4 JP6 JP7 = jumper:JP1E: JUMPER
LCD1 = adafruit:HD44780LCD: HD44780 LCD Standard character type LCDs, available in sizes from 8x1 to 40x4!
LED1-LED4 = led:LED: LED OSRAM: - CHIPLED LG R971, LG N971, LY N971, LG Q971, LY Q971, LO R971, LY R971 LH N974, LH R974 LS Q976, LO Q976, LY Q976 LO Q996 - Hyper CHIPLED LW Q18S LB Q993, LB Q99A, LB R99A - SideLED LS A670, LO A670, LY A670, LG A670, LP A670 LB A673, LV A673, LT A673, LW A673 LH A674 LY A675 LS A676, LA A676, LO A676, LY A676, LW A676 LS A679, LY A679, LG A679 - Hyper Micro SIDELED® LS Y876, LA Y876, LO Y876, LY Y876 LT Y87S - SmartLED LW L88C, LW L88S LB L89C, LB L89S, LG L890 LS L89K, LO L89K, LY L89K LS L896, LA L896, LO L896, LY L896 - TOPLED LS T670, LO T670, LY T670, LG T670, LP T670 LSG T670, LSP T670, LSY T670, LOP T670, LYG T670 LG T671, LOG T671, LSG T671 LB T673, LV T673, LT T673, LW T673 LH T674 LS T676, LA T676, LO T676, LY T676, LB T676, LH T676, LSB T676, LW T676 LB T67C, LV T67C, LT T67C, LS T67K, LO T67K, LY T67K, LW E67C LS E67B, LA E67B, LO E67B, LY E67B, LB E67C, LV E67C, LT E67C LW T67C LS T679, LY T679, LG T679 LS T770, LO T770, LY T770, LG T770, LP T770 LB T773, LV T773, LT T773, LW T773 LH T774 LS E675, LA E675, LY E675, LS T675 LS T776, LA T776, LO T776, LY T776, LB T776 LHGB T686 LT T68C, LB T68C - Hyper Mini TOPLED® LB M676 - Mini TOPLED Santana® LG M470 LS M47K, LO M47K, LY M47K Source: http://www.osram.convergy.de LUXEON: - LUMILED® LXK2-PW12-R00, LXK2-PW12-S00, LXK2-PW14-U00, LXK2-PW14-V00 LXK2-PM12-R00, LXK2-PM12-S00, LXK2-PM14-U00 LXK2-PE12-Q00, LXK2-PE12-R00, LXK2-PE12-S00, LXK2-PE14-T00, LXK2-PE14-U00 LXK2-PB12-K00, LXK2-PB12-L00, LXK2-PB12-M00, LXK2-PB14-N00, LXK2-PB14-P00, LXK2-PB14-Q00 LXK2-PR12-L00, LXK2-PR12-M00, LXK2-PR14-Q00, LXK2-PR14-R00 LXK2-PD12-Q00, LXK2-PD12-R00, LXK2-PD12-S00 LXK2-PH12-R00, LXK2-PH12-S00 LXK2-PL12-P00, LXK2-PL12-Q00, LXK2-PL12-R00 Source: www.luxeon.com KINGBRIGHT: KA-3528ASYC Source: www.kingbright.com
Q1-Q6 = transistor-fet-1:IRL530: MOSFET 17A 22.7nC 100mOhm Logic Level
Q7 Q8 = transistor-neu-to92:2N3904: NPN TRANSISTOR
R1-R62 = rcl:R-US_: RESISTOR, American symbol
S1-S4 = switch-misc:DT: ITT SWITCH
S5 = switch:LPV-1: TOGGLE SWITCH
TR1 TR2 = trafo-xicon:42T?*: Xicon Micro-Mini EI-12 Audio Transformers 42TL/42TC/42TM Series Source: http://www.mouser.com//catalog/specsheets/164201.pdf http://www.mouser.com/catalog/specsheets/114225.pdf http://www.mouser.com/catalog/specsheets/164267.pdf; OC_FARNELL: unknown; OC_NEWARK: unknown
U1 = atmel:MEGA16-P: MICROCONTROLLER 16 Kbytes FLASH 1 kbytes SRAM 512 bytes EEPROM USART 8-channel 10 bit ADC Source: avr.lbr; MPN: ATMEGA16-16PU; OC_FARNELL: 9171142; OC_NEWARK: 01M6885
U2 = linear:LM324: OP AMP
U3 = 40xx:4066: Quad bilateral ANALOG SWITCH
U4 U10 = linear:LM358: OP AMP also LM158; LM258; LM2904 Source: http://cache.national.com/ds/LM/LM158.pdf
U5 = national-semi:LM2941: LDO REGULATOR
U8A = JAEB:MAX548
U8B = ic-package:DIL8: Dual In Line / Socket
U9 = maxim:MAX232: RS232 TRANSCEIVER; MF: MAXIM; MPN: MAX232ACPE+; OC_FARNELL: 9723773; OC_NEWARK: 68K4544
U11-U13 = linear:78*: Positive VOLTAGE REGULATOR Source: http://cache.national.com/ds/LM/LM78L05.pdf http://www.fairchildsemi.com/ds/LM/LM7805.pdf
VR1 VR2 = MusicThingModular:9MM_SNAP-IN_POT_CHASSIS: 9mm vertical snap-in pot, Alpha / Panasonic style, with a connection to the metal chassis for grounding
VR3 = MusicThingModular:ALPHA-9MM-DUALPOT: 9mm vertical snap-in pot, Alpha / Panasonic style, with a connection to the metal chassis for grounding
VR4 = pot:TRIM_US-: POTENTIOMETER
XTAL1 = crystal:CRYSTAL: CRYSTAL; OC_FARNELL: 1667008; OC_NEWARK: unknown

## Net classes
0 default: width 0.4 mm
1 signal: width 0.254 mm
2 pwr: width 2 mm

## Board
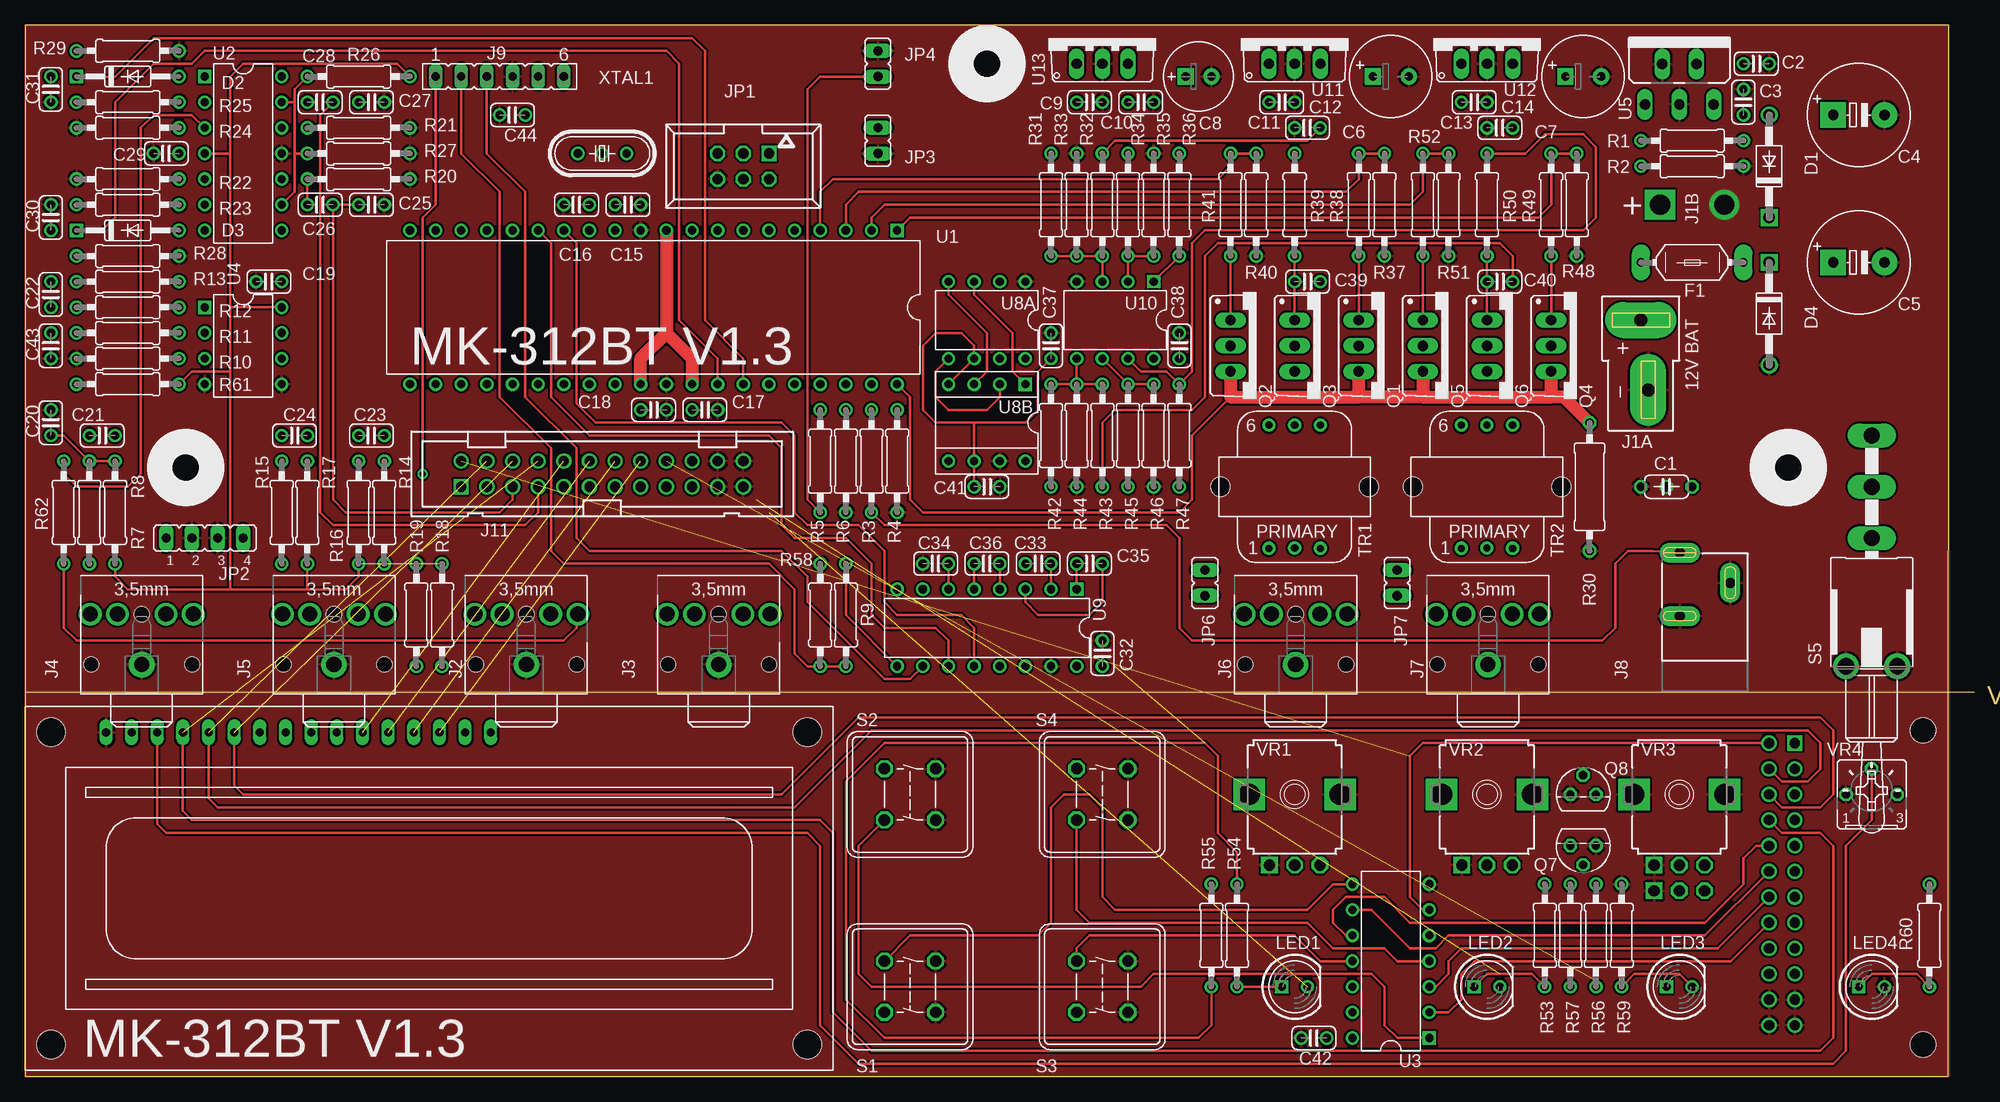
[diagram p5: board, top side]
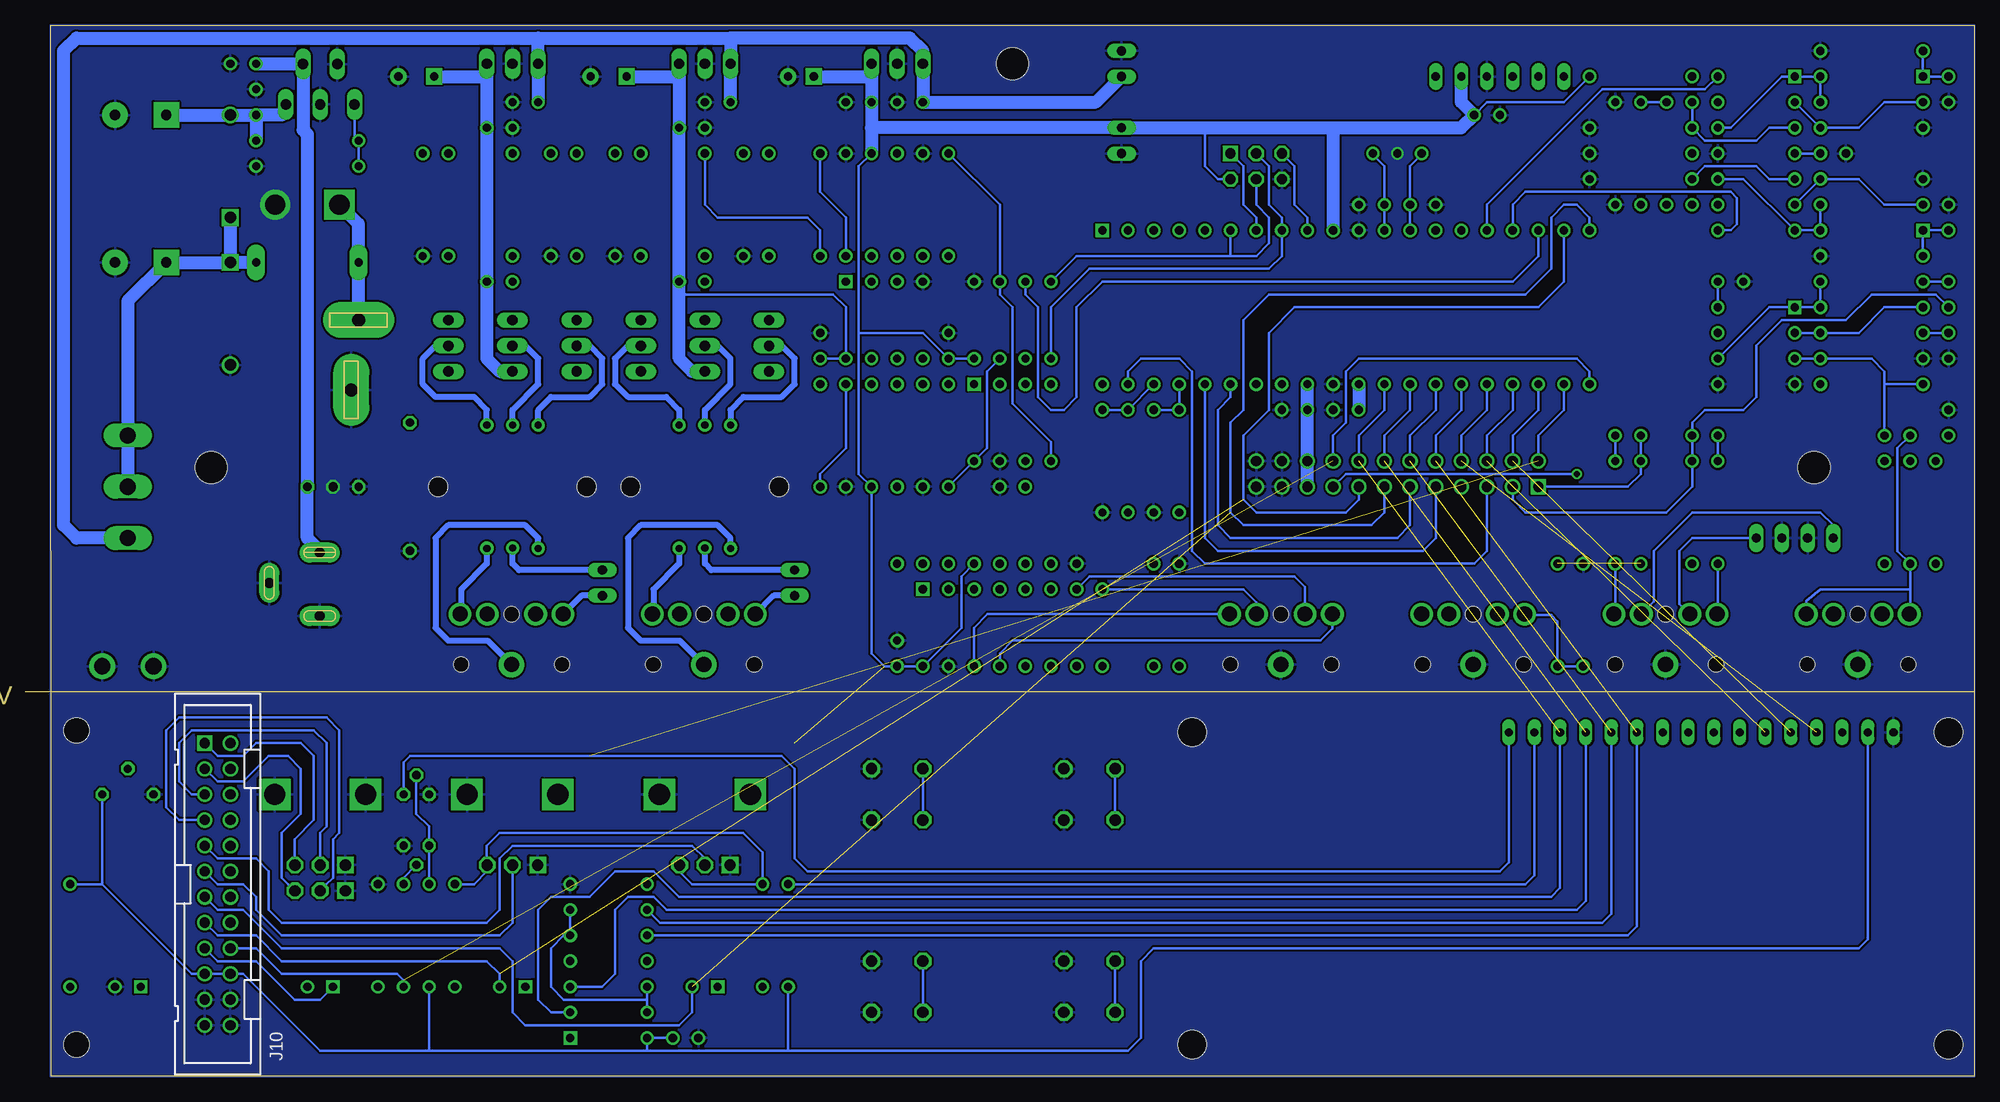
[diagram p6: board, bottom side, seen from below]

Size 193.04 x 104.14 mm. Coordinates in mm from the lower left corner, seen from the top.
Outline: 0,38.1 0,104.14 190.5,104.14 190.48,0 0,0 0,38.1
Outline: 0,38.1 193.04,38.1
Copper layers (1*16): Top 0.035mm / dielectric 1.5mm / Bottom 0.035mm
Design rules "default *": minimum track width 10mil, minimum drill 24mil, track to track 8mil, track to pad 8mil, pad to pad 8mil, via to via 8mil, smd to smd 8mil, copper to edge 0mil, drill to drill 8mil, minimum pad ring 10mil, minimum via ring 8mil, stop-mask expansion 4mil, vias tented up to drill 0mil, thermal gap 10mil
Holes 3.2 mm at 15.88,60.33 174.62,60.33 95.25,100.33
Holes 2.5 mm at 187.96,34.29 187.96,3.17

### Footprints (pad centres in the part's own frame; a part is rotated, then mirrored left to right if it is on the bottom)
C050-024X044 = drill 0.813 octagon: 1 -2.54,0; 2 2.54,0
C025-024X044 = drill 0.813: 1 -1.27,0; 2 1.27,0
E5-10,5 = drill 1.016 pad 2.54 square: + -2.54,0 | drill 1.016 pad 2.54: - 2.54,0
E3,5-8 = drill 0.813 pad 1.6 square: + -1.778,0 | drill 0.813 pad 1.6: - 1.778,0
E2,5-7 = drill 0.813 pad 1.6 square: + -1.27,0 | drill 0.813 pad 1.6: - 1.27,0
DO41-10 = drill 1.118: A 5.08,0 | drill 1.118 square: C -5.08,0
DO35-10 = drill 0.813: A 5.08,0 | drill 0.813 square: C -5.08,0
LITTLEFUSE = drill 0.813 pad 1.778 long: 1 -5.08,0; 2 5.08,0
DEANS = drill 1.27 pad 3.556 long: + 0,0; - 0.737,-6.921
STX3100 = drill 1.5 pad 2.54: 1 2.7,-0.1 | drill 1.5: 2 7.7,5; 3 7.7,2.3; 4 7.7,-2.5; 5 7.7,-5.2 | hole 1.5: 2.7,4.9; 2.7,-5.1; 7.7,-0.1
POWER_JACK_SLOT = drill 1 pad 2 long: GND@1 2.58,7.5; GND@2 7.58,10.8; PWR 2.58,13.8
FE06 = drill 0.813 long: 1 -6.35,0; 2 -3.81,0; 3 -1.27,0; 4 1.27,0; 5 3.81,0; 6 6.35,0
PAK100/2500-24 = drill 1 pad 1.422 square: 1 -13.97,-1.27 | drill 1 pad 1.422: 2 -13.97,1.27; 3 -11.43,-1.27; 4 -11.43,1.27; 5 -8.89,-1.27; 6 -8.89,1.27; 7 -6.35,-1.27; 8 -6.35,1.27; 9 -3.81,-1.27; 10 -3.81,1.27; 11 -1.27,-1.27; 12 -1.27,1.27; 13 1.27,-1.27; 14 1.27,1.27; 15 3.81,-1.27; 16 3.81,1.27; 17 6.35,-1.27; 18 6.35,1.27; 19 8.89,-1.27; 20 8.89,1.27; 21 11.43,-1.27; 22 11.43,1.27; 23 13.97,-1.27; 24 13.97,1.27
057-006-1 = drill 1 square: 1 -2.54,-1.27 | drill 1 octagon: 2 -2.54,1.27; 3 0,-1.27; 4 0,1.27; 5 2.54,-1.27; 6 2.54,1.27
JP4 = drill 0.914 long: 1 -3.81,0; 2 -1.27,0; 3 1.27,0; 4 3.81,0
JP1 = drill 0.914 long: 1 0,-1.27; 2 0,1.27
LCD1602 = drill 0.8 long: 1 8,33.46; 2 10.54,33.46; 3 13.08,33.46; 4 15.62,33.46; 5 18.16,33.46; 6 20.7,33.46; 7 23.24,33.46; 8 25.78,33.46; 9 28.32,33.46; 10 30.86,33.46; 11 33.4,33.46; 12 35.94,33.46; 13 38.48,33.46; 14 41.02,33.46; 15 43.56,33.46; 16 46.1,33.46 | hole 2.8: 2.54,2.54; 2.54,33.46; 77.46,33.46; 77.46,2.54
LED5MM = drill 0.813 square: A -1.27,0 | drill 0.813: K 1.27,0
TO220V = drill 1.016 long: 1 -2.54,-2.54; 2 0,-2.54; 3 2.54,-2.54
TO92 = drill 0.813 octagon: 1 1.27,0; 2 0,1.905; 3 -1.27,0
0207/10 = drill 0.813: 1 -5.08,0; 2 5.08,0
0309/12 = drill 0.813 octagon: 1 -6.35,0; 2 6.35,0
DTE6K = drill 1.118 octagon: 1 -2.54,2.54; 2 2.54,2.54; 3 2.54,-2.54; 4 -2.54,-2.54
LPV-1 = drill 1.6 long: 1 0,12.7; 2 0,17.78; 3 0,22.86 | drill 1.6 pad 2.54: B -2.54,0; B1 2.54,0
42TL = drill 0.7 pad 1.3: 1 -2.54,-6.096; 2 0,-6.068; 3 2.54,-6.096; 4 2.54,6.096; 5 0,6.096; 6 -2.54,6.096 | hole 1.9: -7.353,0; 7.353,0
DIL40 = drill 0.813 square: 1 -24.13,-7.62 | drill 0.813: 2 -21.59,-7.62; 3 -19.05,-7.62; 4 -16.51,-7.62; 5 -13.97,-7.62; 6 -11.43,-7.62; 7 -8.89,-7.62; 8 -6.35,-7.62; 9 -3.81,-7.62; 10 -1.27,-7.62; 11 1.27,-7.62; 12 3.81,-7.62; 13 6.35,-7.62; 14 8.89,-7.62; 15 11.43,-7.62; 16 13.97,-7.62; 17 16.51,-7.62; 18 19.05,-7.62; 19 21.59,-7.62; 20 24.13,-7.62; 21 24.13,7.62; 22 21.59,7.62; 23 19.05,7.62; 24 16.51,7.62; 25 13.97,7.62; 26 11.43,7.62; 27 8.89,7.62; 28 6.35,7.62; 29 3.81,7.62; 30 1.27,7.62; 31 -1.27,7.62; 32 -3.81,7.62; 33 -6.35,7.62; 34 -8.89,7.62; 35 -11.43,7.62; 36 -13.97,7.62; 37 -16.51,7.62; 38 -19.05,7.62; 39 -21.59,7.62; 40 -24.13,7.62
DIL14 = drill 0.813 square: 1 -7.62,-3.81 | drill 0.813: 2 -5.08,-3.81; 3 -2.54,-3.81; 4 0,-3.81; 5 2.54,-3.81; 6 5.08,-3.81; 7 7.62,-3.81; 8 7.62,3.81; 9 5.08,3.81; 10 2.54,3.81; 11 0,3.81; 12 -2.54,3.81; 13 -5.08,3.81; 14 -7.62,3.81
DIL08 = drill 0.813 pad 1.27 square: 1 -3.81,-3.81 | drill 0.813 pad 1.27: 2 -1.27,-3.81; 3 1.27,-3.81; 4 3.81,-3.81; 5 3.81,3.81; 6 1.27,3.81; 7 -1.27,3.81; 8 -3.81,3.81
TO220-5 = drill 1.016 long: 1 -3.4,-6.25; 2 -1.7,-2.25; 3 0,-6.25; 4 1.7,-2.25; 5 3.4,-6.25
DIL08' = drill 0.813 pad 1.27: 1 -3.81,-3.81; 2 -1.27,-3.81; 3 1.27,-3.81; 4 3.81,-3.81; 5 3.81,3.81; 6 1.27,3.81; 7 -1.27,3.81; 8 -3.81,3.81
SOCKET-08 = drill 0.813 square: 1 -3.81,-3.81 | drill 0.813: 2 -1.27,-3.81; 3 1.27,-3.81; 4 3.81,-3.81; 5 3.81,3.81; 6 1.27,3.81; 7 -1.27,3.81; 8 -3.81,3.81
DIL16 = drill 0.813 square: 1 -8.89,-3.81 | drill 0.813: 2 -6.35,-3.81; 3 -3.81,-3.81; 4 -1.27,-3.81; 5 1.27,-3.81; 6 3.81,-3.81; 7 6.35,-3.81; 8 8.89,-3.81; 9 8.89,3.81; 10 6.35,3.81; 11 3.81,3.81; 12 1.27,3.81; 13 -1.27,3.81; 14 -3.81,3.81; 15 -6.35,3.81; 16 -8.89,3.81
9MM_SNAP-IN_POT = drill 1.1 square: 1 -2.5,-7 | drill 1.1 octagon: 2 0,-7; 3 2.5,-7 | drill 2.1 square: CHASSIS1 -4.5,0; CHASSIS2 4.5,0
DUAL_9MM_SNAP-IN_POT = drill 1.1 square: 1 -2.5,-7; 1B -2.5,-9.54 | drill 1.1 octagon: 2 0,-7; 2B 0,-9.54; 3 2.5,-7; 3B 2.5,-9.54 | drill 2.1 square: CHASSIS1 -4.5,0; CHASSIS2 4.5,0
B25P = drill 0.813 octagon: A -2.54,0; E 2.54,0; S 0,2.54
HC49/S = drill 0.813: 1 -2.413,0; 2 2.413,0

### Placement (x,y rotation side)
C1  162.56,58.42 180 top
C2  171.45,100.33 0 top
C3  170.18,96.52 90 top
C4  181.61,95.25 0 top
C5  181.61,80.64 0 top
C6  135.25,99.06 0 top
C7  154.31,99.06 0 top
C8  116.2,99.06 0 top
C9  105.41,96.52 0 top
C10  110.49,96.52 0 top
C11  124.46,96.52 0 top
C12  127,93.98 180 top
C13  143.51,96.52 0 top
C14  146.05,93.98 180 top
C15  59.69,86.36 0 top
C16  54.61,86.36 180 top
C17  67.31,66.04 0 top
C18  62.23,66.04 0 top
C19  24.13,78.74 180 top
C20  2.54,64.77 90 top
C21  7.62,63.5 0 top
C22  2.54,77.47 90 top
C23  34.29,63.5 180 top
C24  26.67,63.5 0 top
C25  34.29,86.36 0 top
C26  29.21,86.36 180 top
C27  34.29,96.52 0 top
C28  29.21,96.52 180 top
C29  13.97,91.44 180 top
C30  2.54,85.09 90 top
C31  2.54,97.79 270 top
C32  106.68,41.91 90 top
C33  100.33,50.8 0 top
C34  90.17,50.8 180 top
C35  105.41,50.8 0 top
C36  95.25,50.8 180 top
C37  101.6,72.39 90 top
C38  114.3,72.39 90 top
C39  127,78.74 0 top
C40  146.05,78.74 0 top
C41  95.25,58.42 0 top
C42  127.64,3.81 180 top
C43  2.54,72.39 270 top
C44  48.26,95.25 180 top
D1  172.72,90.17 90 top
D2  10.16,99.06 0 top
D3  10.16,83.82 0 top
D4  172.72,75.56 270 top
F1  165.1,80.64 0 top
J1  160.02,74.93 0 top
J2  49.53,38.1 90 top
J3  68.58,38.1 90 top
J4  11.43,38.1 90 top
J5  30.48,38.1 90 top
J6  125.73,38.1 90 top
J7  144.78,38.1 90 top
J8  161.29,38.1 0 top
J9  46.99,99.06 0 top
J10  173.99,19.05 270 bottom
J11  57.15,59.69 0 top
JP1  71.12,90.17 180 top
JP2  17.78,53.34 0 top
JP3  84.45,92.71 180 top
JP4  84.45,100.33 0 top
JP6  116.84,48.9 180 top
JP7  135.89,48.9 180 top
LCD1  0,0.64 0 top
LED1  125.73,8.89 0 top
LED2  144.78,8.89 0 top
LED3  163.83,8.89 0 top
LED4  182.88,8.89 0 top
Q1  134.62,72.39 270 top
Q2  121.92,72.39 270 top
Q3  128.27,72.39 270 top
Q4  153.67,72.39 270 top
Q5  140.97,72.39 270 top
Q6  147.32,72.39 270 top
Q7  154.31,22.86 180 top
Q8  154.31,27.94 0 top
R1  165.1,92.71 0 top
R2  165.1,90.17 180 top
R3  83.82,60.96 270 top
R4  86.36,60.96 90 top
R5  78.74,60.96 270 top
R6  81.28,60.96 90 top
R7  6.35,55.88 90 top
R8  8.89,55.88 270 top
R9  81.28,45.72 90 top
R10  10.16,71.12 0 top
R11  10.16,73.66 0 top
R12  10.16,76.2 0 top
R13  10.16,78.74 180 top
R14  35.56,55.88 90 top
R15  25.4,55.88 90 top
R16  33.02,55.88 270 top
R17  27.94,55.88 270 top
R18  41.27,45.72 90 top
R19  38.73,45.72 270 top
R20  33.02,88.9 180 top
R21  33.02,93.98 180 top
R22  10.16,88.9 0 top
R23  10.16,86.36 0 top
R24  10.16,93.98 180 top
R25  10.16,96.52 0 top
R26  33.02,99.06 0 top
R27  33.02,91.44 0 top
R28  10.16,81.28 0 top
R29  10.16,101.6 0 top
R30  154.94,58.42 90 top
R31  101.6,86.36 270 top
R32  106.68,86.36 90 top
R33  104.14,86.36 270 top
R34  109.22,86.36 90 top
R35  111.76,86.36 270 top
R36  114.3,86.36 270 top
R37  134.62,86.36 90 top
R38  132.08,86.36 270 top
R39  125.73,86.36 270 top
R40  121.92,86.36 90 top
R41  119.38,86.36 270 top
R42  101.6,63.5 90 top
R43  106.68,63.5 270 top
R44  104.14,63.5 90 top
R45  109.22,63.5 270 top
R46  111.76,63.5 90 top
R47  114.3,63.5 90 top
R48  153.67,86.36 90 top
R49  151.13,86.36 270 top
R50  144.78,86.36 270 top
R51  140.97,86.36 90 top
R52  138.43,86.36 270 top
R53  150.5,13.97 90 top
R54  120.02,13.97 90 top
R55  117.47,13.97 270 top
R56  155.57,13.97 270 top
R57  153.03,13.97 90 top
R58  78.74,45.72 270 top
R59  158.12,13.97 90 top
R60  188.59,13.97 90 top
R61  10.16,68.58 0 top
R62  3.81,55.88 90 top
S1  87.63,8.89 90 top
S2  87.63,27.94 90 top
S3  106.68,8.89 90 top
S4  106.68,27.94 90 top
S5  182.88,40.64 0 top
TR1  125.73,58.42 0 top
TR2  144.78,58.42 0 top
U1  62.23,76.2 180 top
U2  21.59,91.44 270 top
U3  135.25,11.43 90 top
U4  21.59,72.39 270 top
U5  163.83,102.55 0 top
U8A  MAX548  [DIL08']  95.25,74.93 180 top
U8B  95.25,64.77 180 top
U9  95.25,44.45 180 top
U10  107.95,74.93 180 top
U11  125.73,102.87 0 top
U12  144.78,102.87 0 top
U13  106.68,102.87 0 top
VR1  125.73,27.94 0 top
VR2  144.78,27.94 0 top
VR3  163.83,27.94 0 top
VR4  182.88,27.94 0 top
XTAL1  57.15,91.44 180 top

### Tracks (layer width: path | path; a pad name or v marks a point on that pad's centre or on a via)
!CS
  Top 0.254: U8B.1 97.79,69.85 97.79,73.66 93.98,77.47 U8A.3
  Bottom 0.254: U8A.3 93.98,77.47 92.71,76.2 92.71,67.31 91.44,66.04 90.17,66.04 88.9,67.31 88.9,76.2 86.36,78.74 45.72,78.74 43.18,81.28 U1.18
+5V  (2 unrouted)
  Top 0.254: U4.8 20.32,76.2 | 20.32,76.2 20.32,69.85 | U2.4 20.32,91.44 | 20.32,91.44 20.32,76.2 | 20.32,91.44 20.32,99.06 21.59,100.33 36.83,100.33 R26.2 | U8B.4 U8A.6 93.98,72.39 92.71,73.66 90.17,73.66 88.9,72.39 88.9,66.04 90.17,64.77 93.98,64.77 | 93.98,64.77 U8B.6 C41.1 | 93.98,64.77 99.06,64.77 100.33,66.04 100.33,69.85 C37.1 | R54.2 120.02,22.23 118.11,24.13 118.11,31.75 116.84,33.02 85.09,33.02 81.28,29.21 81.28,7.62 85.09,3.81 116.2,3.81 117.47,5.08 R55.2 | R61.2 16.51,69.85 20.32,69.85 | 20.32,69.85 20.32,48.26 | 20.32,48.26 27.94,48.26 | 27.94,48.26 31.75,48.26 33.02,49.53 R16.2 | R17.2 27.94,48.26 | 20.32,48.26 10.16,48.26 8.89,49.53 R8.2
  Top 1.27: 63.5,73.66 66.04,71.12 U1.32 | U1.30 60.96,71.12 63.5,73.66 | U1.10 63.5,73.66
  Bottom 0.254: R34.2 110.49,90.17 110.49,73.66 | 110.49,73.66 110.49,59.69 R45.2 109.22,41.91 107.95,40.64 C32.1 U9.16 100.33,44.45 100.33,49.53 C33.1 | C19.1 U4.8 | C29.1 U2.4 | 110.49,73.66 104.14,73.66 C37.1 U8A.8 | R26.2 40.64,96.52 48.26,96.52 C44.1 | VR1.3 128.23,20.36 | 128.23,20.36 128.27,20.32 | VR4.E 185.42,19.05 | 185.42,19.05 R60.2 | 153.03,2.54 163.83,2.54 171.45,10.16 J10.20 J10.19 176.53,10.16 185.42,19.05 | R57.1 153.03,2.54 | R55.2 117.47,2.54 | 117.47,2.54 131.44,2.54 | 131.44,2.54 153.03,2.54 | 131.44,2.54 U3.14 C42.1 | 128.23,20.36 128.23,20.28 127,19.05 R54.2 120.02,22.23 121.92,24.13 146.05,24.13 147.32,22.86 147.32,20.98 VR2.3 147.28,20.36 148.59,19.05 R53.2 | LCD1.2 10.54,13.59 11.43,12.7 81.28,12.7 82.55,11.43 82.55,3.81 83.82,2.54 117.47,2.54 | JP1.2 74.93,88.9 76.2,90.17 76.2,93.98
  Bottom 1.27: U13.3 109.22,99.06 | 109.22,99.06 C10.1 109.22,93.98 | 109.22,93.98 R34.2 | J11.19 J11.20 C17.1 U1.32 | U1.30 C18.1 | J9.5 50.8,96.52 C44.1 50.8,93.98 63.5,93.98 | C8.+ 109.22,99.06 | 109.22,93.98 JP3.1 76.2,93.98 63.5,93.98 | 63.5,93.98 U1.10
+8V
  Top 0.254: R32.2 107.95,92.71 127,92.71 C12.1
  Bottom 0.254: C38.1 U10.8 111.76,76.2 113.03,77.47 128.27,77.47
  Bottom 1.27: U11.3 128.27,99.06 | 128.27,99.06 C12.1 C39.2 128.27,77.47 128.27,71.12 127,69.85 Q3.3 | C6.+ 128.27,99.06
+9V
  Top 0.254: R43.2 106.68,64.77 107.95,66.04 115.57,66.04 116.84,67.31 116.84,81.28 118.11,82.55 146.05,82.55 147.32,81.28 C40.2
  Bottom 1.27: U12.3 147.32,99.06 | 147.32,99.06 C14.1 C40.2 147.32,71.12 146.05,69.85 Q6.3 | C7.+ 147.32,99.06
+12V
  Top 0.254: R5.2 77.47,57.15 77.47,97.79 78.74,99.06 JP4.1
  Bottom 1.27: C13.1 U12.1 142.24,102.87 | C11.1 U11.1 123.19,102.87 | 142.24,102.87 123.19,102.87 | 123.19,102.87 105.41,102.87 104.14,101.6 U13.1 C9.1 87,96.52 JP4.1 | S5.1 187.96,53.34 189.23,54.61 189.23,101.6 187.96,102.87 142.24,102.87
GND  (via drill 0.8, 0.9, 2 pad 2.54)
  other vias: 57.15,91.44 168.28,86.36 162.56,58.42
  pour Bottom: 0,104.14 190.5,104.14 190.5,0 0,0
  pour Top: 0,104.14 190.5,104.14 190.5,0 0,0
N$1
  Bottom 0.254: VR3.2B 163.21,19.04 162.56,19.68 162.56,23.5 161.93,24.13 161.93,34.29 163.19,35.56 177.8,35.56 179.07,34.29 179.07,26.67 177.8,25.4 J10.7
N$2
  Bottom 0.254: U1.37 R5.1 R6.2
N$3
  Bottom 0.254: U1.38 R3.1 R4.2
N$4
  Top 0.254: U3.8 129.54,19.05 127,16.51 107.95,16.51 106.68,17.78 106.68,26.67 105.41,27.94 102.87,27.94 101.6,26.67 101.6,15.24 100.33,13.97 87.63,13.97 S1.2
  Bottom 0.254: S1.2 S1.1
N$5
  Top 0.254: U3.11 128.27,11.43 125.73,13.97 105.41,13.97 104.14,12.7 S3.2
  Bottom 0.254: S3.2 S3.1
N$6
  Bottom 0.61: TR1.5 125.73,66.04 123.19,68.58 123.19,71.12 124.46,72.39 Q3.2
N$7
  Top 0.254: U3.4 135.89,11.43 134.62,12.7 129.54,12.7 127,15.24 105.41,15.24 104.14,16.51 S4.1
  Bottom 0.254: S4.2 S4.1
N$8
  Bottom 0.61: TR2.5 144.78,66.04 142.24,68.58 142.24,71.12 143.51,72.39 Q6.2
N$9
  Bottom 0.61: JP7.1 144.15,50.16 144.78,50.8 TR2.2
N$10
  Bottom 0.254: VR3.3B 166.99,19.04 167.64,19.68 167.64,24.13 165.74,26.04 165.74,30.48 167,31.75 168.91,31.75 171.45,29.21 173.99,29.21 J10.3
N$11
  Bottom 0.254: J10.9 173.99,21.59 170.18,21.59 168.91,20.32 168.91,16.51 167.64,15.24 147.32,15.24 146.05,16.51 146.05,21.59 144.78,22.86 127,22.86 125.73,21.59 VR1.2
N$12
  Bottom 0.254: J10.11 173.99,19.05 171.45,19.05 170.18,17.78 170.18,16.51 167.64,13.97 146.05,13.97 144.78,15.24 VR2.2
N$13
  Bottom 0.254: J10.1 173.99,31.75 171.45,31.75 170.18,33.02 165.74,33.02 164.47,31.75 164.47,25.4 166.37,23.5 166.37,20.98 VR3.3
N$14
  Top 0.254: U2.3 16.51,95.25 12.7,95.25 11.43,93.98 11.43,59.69 10.16,58.42 5.08,58.42 3.81,59.69 R62.2
  Bottom 0.254: U2.3 20.32,93.98 21.59,92.71 26.67,92.71 R21.2 C28.2
N$15
  Bottom 0.254: J10.5 176.53,27.94 177.8,29.21 177.8,33.02 176.53,34.29 164.47,34.29 163.19,33.02 163.19,24.77 163.83,24.13 VR3.2
N$16
  Bottom 0.61: TR1.1 123.19,53.34 124.46,54.61 132.08,54.61 133.35,53.34 133.35,44.45 132.08,43.18 128.21,43.18 J6.1
N$17
  Bottom 0.254: U1.13 C16.1 55.88,90.17 54.74,91.31 XTAL1.2
N$18
  Top 0.254: Q1.1 R38.2
N$19
  Top 0.254: R41.2 Q2.1
N$20
  Bottom 0.61: JP7.2 137.96,47.62 J7.2
N$21
  Top 0.254: Q3.1 C39.1 R39.2
N$22
  Top 0.254: U10.3 R32.1 R33.2 R31.2
N$23
  Top 0.254: LED2.A 144.78,10.16 149.22,10.16 R53.1
N$24
  Top 0.254: Q4.1 R49.2
N$25
  Top 0.254: Q5.1 R52.2
N$26
  Bottom 0.61: TR2.1 142.24,53.34 143.51,54.61 151.13,54.61 152.4,53.34 152.4,44.45 151.13,43.18 147.26,43.18 J7.1
N$27
  Top 0.254: Q6.1 C40.1 R50.2
N$28
  Top 0.254: R42.2 R44.2 | R43.1 R44.2 | U10.5 R44.2
N$29
  Top 0.254: LED1.A R54.1
N$30
  Top 0.254: LCD1.3 13.08,25.02 13.97,24.13 77.47,24.13 78.74,22.86 78.74,5.08 82.55,1.27 179.07,1.27 180.34,2.54 180.34,22.86 182.88,25.4 VR4.S
N$31  (via drill 2 pad 2.54)
  Bottom 1.27: J1.+ F1.1 160.02,84.45 v161.93,86.36
N$32
  Bottom 0.254: U1.12 C15.1 58.42,90.17 59.56,91.31 XTAL1.1
N$33
  Top 0.254: U9.9 81.28,45.72 R9.2
N$34
  Bottom 0.61: Q1.2 133.35,72.39 134.62,71.12 134.62,68.58 133.35,67.31 129.54,67.31 128.27,66.04 TR1.4
N$35
  Bottom 0.61: TR1.3 128.27,50.8 130.81,48.26 130.81,45.92 J6.5
N$36
  Bottom 0.61: Q4.2 152.4,72.39 153.67,71.12 153.67,68.58 152.4,67.31 148.59,67.31 147.32,66.04 TR2.4
N$37
  Bottom 0.61: TR2.3 147.32,50.8 149.86,48.26 149.86,45.92 J7.5
N$38
  Bottom 0.61: Q5.2 137.16,72.39 135.89,71.12 135.89,68.58 137.16,67.31 140.97,67.31 142.24,66.04 TR2.6
N$39
  Bottom 0.61: Q2.2 118.11,72.39 116.84,71.12 116.84,68.58 118.11,67.31 121.92,67.31 123.19,66.04 TR1.6
N$40
  Top 0.254: U10.2 R34.1 R35.2
  Bottom 0.254: R36.1 114.3,87.63 111.76,85.09 R35.2
N$41
  Top 0.254: R46.2 R45.1 U10.6
  Bottom 0.254: R47.1 114.3,59.69 111.76,62.23 R46.2
N$42
  Bottom 0.254: U8B.5 91.44,62.87 95.25,66.67 95.25,76.2 96.52,77.47 U8A.2 96.52,86.36 R31.1
N$43
  Bottom 0.254: U5.1 160.43,93.12 R1.1 R2.2
N$44
  Bottom 0.254: J3.5 97.71,45.8 99.06,44.45 U9.14
N$45
  Bottom 1.27: C4.+ D1.A C3.1 | C3.1 R1.2 | U5.5 167.23,95.66 167.64,95.25 C3.1
N$46
  Bottom 0.254: J3.2 63.58,44.37 64.77,43.18 95.25,43.18 96.52,41.91 U9.13
N$47
  Bottom 0.254: LCD1.15 43.56,19.94 44.45,19.05 R55.1
N$48
  Bottom 0.61: JP6.2 118.91,47.62 J6.2
N$49
  Bottom 0.254: C43.1 R11.1
N$50
  Top 0.254: R62.1 3.81,44.45 5.08,43.18 53.34,43.18 54.61,44.45 54.61,45.68 J2.5
N$51
  Bottom 0.61: JP6.1 125.09,50.16 125.73,50.8 TR1.2
N$52
  Top 0.254: U9.1 C35.1
N$53
  Bottom 0.254: U2.2 R24.1 11.43,93.98 8.89,96.52 R25.1
N$54
  Bottom 0.254: R25.2 D2.A U2.1 19.05,99.06 24.13,93.98 U2.12
N$55
  Bottom 0.254: R15.1 25.4,45.88 J5.2
N$56
  Bottom 0.254: R14.1 35.56,45.92 J5.5
N$57
  Bottom 0.254: R14.2 C23.1
N$58
  Bottom 0.254: R19.2 R18.1 41.27,45.09 41.91,45.72 44.45,45.72 J2.2
N$59
  Bottom 0.254: JP2.1 13.97,54.61 15.24,55.88 27.94,55.88 31.75,52.07 31.75,47.03 J5.4
N$60
  Bottom 0.254: U2.6 R22.2 11.43,88.9 8.89,86.36 R23.1
N$61
  Top 0.254: C35.2 106.68,46.99 105.41,45.72 100.33,45.72 99.06,46.99 U9.3
N$62
  Top 0.254: U2.9 26.67,87.63 26.67,91.44 | 26.67,91.44 R27.1 | U2.13 26.67,96.52 | 26.67,96.52 26.67,91.44 | R26.1 26.67,97.79 26.67,96.52
N$63
  Top 0.254: C26.2 R20.2
  Bottom 0.254: U2.5 20.32,88.9 21.59,90.17 26.67,90.17 R20.2
N$64
  Bottom 0.254: JP2.4 27.94,53.34 29.21,52.07 29.21,46.83 J5.3
N$65
  Bottom 0.254: R15.2 C24.1
N$66
  Top 0.254: U9.5 C36.2
N$67
  Top 0.254: U9.4 C36.1
N$68
  Top 0.254: J9.2 43.18,91.44 46.99,87.63 46.99,67.31 52.07,62.23 52.07,52.07 53.34,50.8 73.66,50.8 76.2,48.26 76.2,41.91 77.47,40.64 R58.2 R9.1
N$69
  Bottom 0.254: R23.2 D3.A U2.7 22.86,88.9 U2.10
N$70
  Top 0.254: U9.6 C34.1
N$71
  Bottom 0.254: J4.5 16.63,47.11 15.24,48.26 6.35,48.26 | 6.35,45.88 6.35,45.72 J4.2 6.35,45.88 | 6.35,48.26 R7.1 7.62,52.07 7.62,62.23 C21.1 | 6.35,48.26 6.35,45.88
N$72
  Top 0.254: R8.1 R7.2 3.81,63.5 C20.1
N$73
  Bottom 0.254: U4.3 R10.2 10.16,71.12 8.89,69.85 8.89,68.58 | C21.2 8.89,68.58 | R61.1 8.89,68.58
N$74
  Bottom 0.254: U4.2 R11.2 11.43,73.66 8.89,76.2 R12.1
N$75
  Bottom 0.254: R13.1 R12.2 U4.1 20.32,76.2 U4.6
N$76
  Bottom 0.254: C22.2 R13.2
N$77
  Top 0.254: U9.2 C33.2
N$78
  Bottom 1.27: S5.2 S5.3 182.88,76.83 C5.+ D4.C | F1.2 D4.C | D1.C D4.C
N$79
  Top 0.254: LED3.K 163.83,10.16 159.38,10.16 R59.1
N$80
  Top 0.254: S2.1 82.55,22.86 82.55,10.16 83.82,8.89 110.49,8.89 111.76,10.16 133.35,10.16 134.62,8.89 134.62,5.08 135.89,3.81 U3.1
  Bottom 0.254: S2.2 S2.1
N$81
  Top 0.254: R60.1 187.32,10.16 182.88,10.16 LED4.A
N$82
  Bottom 0.254: R56.1 155.57,19.68 Q7.2
N$83
  Bottom 0.254: R57.2 Q7.1 153.03,24.77 154.31,26.04 Q8.2
N$84
  Bottom 0.254: LCD1.16 46.1,21.21 46.99,20.32 115.57,20.32 116.84,21.59 116.84,30.48 118.11,31.75 154.94,31.75 155.57,31.11 Q8.1
N$85
  Bottom 0.254: U8A.7 97.79,69.85 97.79,62.23 U8B.8 R42.1
N$86
  Bottom 0.254: J10.17 173.99,11.43 170.18,11.43 166.37,7.62 163.83,7.62 LED3.A
N$87
  Bottom 0.254: U9.8 72.39,48.26 71.08,46.95 J3.4
N$88
  Bottom 0.254: U9.7 87.63,49.53 67.31,49.53 66.28,48.5 J3.3
N$89
  Top 0.254: U9.10 87.63,39.37 85.09,39.37 77.47,46.99 77.47,49.53 74.93,52.07 55.88,52.07 54.61,53.34 54.61,62.23 49.53,67.31 49.53,87.63 45.72,91.44 J9.3
PA0
  Top 0.254: U1.40 87.63,67.31 87.63,57.15 88.9,55.88 114.3,55.88 115.57,57.15 115.57,63.5 119.38,67.31
  Top 1.27: Q2.3 119.38,67.31 132.08,67.31 | 132.08,67.31 Q1.3 | 138.43,67.31 132.08,67.31 | Q5.3 138.43,67.31 | 138.43,67.31 151.13,67.31 | 151.13,67.31 Q4.3 | R30.2 152.4,67.31 151.13,67.31
PA1
  Top 0.254: C25.1 C26.1 30.48,57.15 31.75,55.88 46.99,55.88 48.26,57.15 J11.5
  Bottom 0.254: J11.5 48.26,52.07 49.53,50.8 76.2,50.8 77.47,52.07 77.47,69.85 78.74,71.12 82.55,71.12 83.82,69.85 U1.39
PA4
  Bottom 0.254: U1.36 76.2,53.34 74.93,52.07 54.61,52.07 53.34,53.34 J11.9
PA5
  Bottom 0.254: U1.35 73.66,67.31 74.93,66.04 74.93,54.61 73.66,53.34 57.15,53.34 55.88,54.61 J11.11
PA6
  Top 0.254: D2.C 8.89,99.06 12.7,102.87 66.04,102.87 67.31,101.6 67.31,74.93 71.12,71.12 U1.34
  Bottom 0.254: R29.1 D2.C C31.1
PA7
  Top 0.254: U1.33 68.58,71.12 64.77,74.93 64.77,100.33 63.5,101.6 17.78,101.6 16.51,100.33 12.7,100.33 8.89,96.52 8.89,85.09 7.62,83.82 D3.C
  Bottom 0.254: R28.1 D3.C C30.1
PB0
  Top 0.254: R48.2 R49.1 151.13,86.36 149.86,85.09 87.63,85.09 U1.1
PB1
  Top 0.254: R51.2 R52.1 138.43,87.63 137.16,86.36 85.09,86.36 83.82,85.09 U1.2
PB2
  Top 0.254: R37.2 R38.1 132.08,88.9 130.81,87.63 82.55,87.63 81.28,86.36 U1.3
PB3
  Top 0.254: U1.4 78.74,87.63 80.01,88.9 118.11,88.9 119.38,90.17 R41.1 R40.2
PB5
  Top 0.254: U8B.3 95.25,69.85 95.25,73.66 91.44,77.47 U8A.4
  Bottom 0.254: U8A.4 88.9,81.28 73.66,81.28 | U1.6 73.66,81.28 | JP1.4 71.12,86.36 69.85,85.09 69.85,82.55 71.12,81.28 73.66,81.28
PB6
  Bottom 0.254: JP1.1 72.39,90.17 72.39,86.36 71.12,85.09 U1.7
PB7
  Top 0.254: U8A.5 90.17,69.85 90.17,67.31 91.44,66.04 95.25,66.04 96.52,67.31 U8B.2
  Bottom 0.254: U8A.5 91.44,76.2 87.63,80.01 69.85,80.01 68.58,81.28 U1.8 68.58,85.09 69.85,86.36 69.85,90.17 JP1.3
PC0  (1 unrouted)
  Top 0.254: J10.2 138.43,33.02 137.16,31.75 137.16,17.78 138.43,16.51 U3.6
  Bottom 0.254: J11.2 43.18,63.5 40.64,66.04 U1.22 | U3.13 131.44,7.62 | 131.44,7.62 U3.12 | U3.6 U3.5 139.7,13.97 140.97,12.7 140.97,8.89 139.7,7.62 131.44,7.62
PC1  (1 unrouted)
  Top 0.254: J10.4 173.99,29.21 176.53,29.21 177.8,30.48 177.8,33.02 176.53,34.29 83.82,34.29 76.2,26.67 19.05,26.67 18.16,27.56 LCD1.5
  Bottom 0.254: U1.23 43.18,66.04 45.72,63.5 J11.4
PC2  (1 unrouted)
  Top 0.254: J10.6 173.99,26.67 177.8,26.67 179.07,27.94 179.07,34.29 177.8,35.56 82.55,35.56 74.93,27.94 21.59,27.94 20.7,28.83 LCD1.6
  Bottom 0.254: J11.6 48.26,63.5 45.72,66.04 U1.24
PC3  (1 unrouted)
  Top 0.254: LCD1.4 15.62,26.29 16.51,25.4 78.74,25.4 80.01,24.13 80.01,6.35 83.82,2.54 177.8,2.54 179.07,3.81 179.07,22.86 177.8,24.13 173.99,24.13 J10.8
  Bottom 0.254: U1.25 48.26,66.04 50.8,63.5 J11.8
PC4  (1 unrouted)
  Top 0.254: U3.10 130.81,13.97 129.54,15.24 129.54,16.51 130.81,17.78 134.62,17.78 137.16,15.24 166.37,15.24 170.18,19.05 170.18,21.59 171.45,22.86 J10.10
  Bottom 0.254: J11.10 53.34,63.5 50.8,66.04 U1.26 | LCD1.11 33.4,14.86 34.29,13.97 U3.10
PC5  (1 unrouted)
  Top 0.254: U3.9 133.35,16.51 137.16,12.7 139.7,12.7 140.97,13.97 166.37,13.97 J10.12
  Bottom 0.254: U1.27 53.34,66.04 55.88,63.5 J11.12 | LCD1.12 35.94,16.13 36.83,15.24 130.18,15.24 U3.9
PC6  (1 unrouted)
  Top 0.254: J10.14 167.64,12.7 142.24,12.7 140.97,11.43 140.97,10.16 139.7,8.89 U3.3
  Bottom 0.254: J11.14 58.42,63.5 55.88,66.04 U1.28 | LCD1.13 38.48,17.4 39.37,16.51 129.54,16.51 130.81,17.78 133.35,17.78 134.62,16.51 134.62,10.16 135.89,8.89 U3.3
PC7  (1 unrouted)
  Top 0.254: J10.16 168.91,11.43 143.51,11.43 142.24,10.16 142.24,7.62 140.97,6.35 U3.2
  Bottom 0.254: U1.29 58.42,66.04 60.96,63.5 J11.16 | LCD1.14 41.02,18.67 41.91,17.78 128.27,17.78 130.81,20.32 134.62,20.32 137.16,17.78 140.97,17.78 142.24,16.51 142.24,7.62 140.97,6.35 U3.2
PD0
  Top 0.254: U9.12 93.98,44.45 92.71,45.72 86.36,45.72 85.09,46.99 85.09,52.07 82.55,54.61 77.47,54.61 76.2,55.88 76.2,63.5 74.93,64.77 56.52,64.77 54.61,66.67 54.61,82.55 U1.14
PD1
  Top 0.254: U1.15 52.07,82.55 52.07,67.31 55.88,63.5 73.66,63.5 74.93,62.23 74.93,54.61 76.2,53.34 81.28,53.34 83.82,50.8 83.82,45.72 85.09,44.45 90.17,44.45 91.44,43.18 U9.11
PD2
  Bottom 0.254: U2.14 26.67,97.79 36.83,97.79 48.26,86.36 U1.16
PD3
  Bottom 0.254: U1.17 45.72,86.36 44.45,87.63 24.13,87.63 23.5,87 23.5,84.45 24.13,83.82 U2.8
PD5  (1 unrouted)
  Bottom 0.254: U1.19 40.64,78.74 43.18,76.2 67.31,76.2 69.85,73.66 69.85,66.04 72.39,63.5 72.39,57.15 71.12,55.88 62.23,55.88 60.96,57.15 J11.15 | LED2.K 146.05,10.16 147.32,11.43 167.64,11.43 170.18,13.97 173.99,13.97 J10.15
PD6  (1 unrouted)
  Bottom 0.254: U1.20 38.1,85.09 39.37,86.36 40.64,86.36 41.91,85.09 41.91,80.01 44.45,77.47 69.85,77.47 72.39,74.93 72.39,66.04 73.66,64.77 73.66,55.88 72.39,54.61 59.69,54.61 58.42,55.88 J11.13 | J10.13 173.99,16.51 171.45,16.51 167.64,12.7 146.05,12.7 144.78,11.43 144.78,6.35 143.51,5.08 128.27,5.08 127,6.35 LED1.K
PD7  (1 unrouted)
  Bottom 0.254: J11.18 63.5,63.5 62.23,64.77 62.23,69.85 60.96,71.12 39.37,71.12 38.1,69.85 U1.21 | R56.2 155.57,9.53 156.21,10.16 167.64,10.16 170.18,12.7 J10.18
PFET_A
  Top 0.254: U10.1 R36.2
  Bottom 0.254: R39.1 125.73,86.36 124.46,85.09 115.57,85.09 114.3,83.82 R36.2
PFET_B
  Top 0.254: R50.1 148.59,91.44 150.5,93.34 154.31,93.34 155.57,92.08 155.57,85.09 154.31,83.82 116.84,83.82 115.57,82.55 115.57,69.85 R47.2 113.03,69.85 110.49,69.85 U10.7
RB4
  Top 0.254: J11.7 50.8,55.88 49.53,54.61 30.48,54.61 29.21,55.88 29.21,95.25 C28.1
  Bottom 0.254: C28.1 C27.1
RB9
  Bottom 0.254: J11.3 45.72,57.15 44.45,55.88 30.48,55.88 27.94,58.42 R17.1 C24.2 27.94,64.77 26.67,66.04 22.86,66.04 21.59,67.31 21.59,72.39 19.05,74.93 12.7,74.93 10.16,77.47 3.81,77.47 C22.1
RB10
  Bottom 0.254: C23.2 R16.1 33.02,59.69 34.29,58.42 J11.1
RESET
  Bottom 0.254: U1.9 66.04,85.09 67.31,86.36 67.31,90.17 JP1.5
STATE  (via drill 0.6)
  Top 0.254: v39.37,59.69 39.37,85.09 40.64,86.36 J9.1
  Bottom 0.254: J11.17 62.23,59.69 v39.37,59.69
V+
  Top 0.254: R3.2 85.09,54.61 113.03,54.61 114.3,53.34 114.3,44.45 115.57,43.18 156.21,43.18 157.48,44.45 157.48,50.8 158.75,52.07 161.16,52.07 J8.PWR
  Bottom 1.27: J8.PWR 163.87,52.11 165.1,53.34 C1.1 165.1,93.34 165.53,93.78 U5.4 165.88,100.33 C2.1

### Text on the board
Dimension: V-CUT
tPlace: PRIMARY | PRIMARY
tNames: + | J1B | MK-312BT V1.3 | 12V BAT | J1A | MK-312BT V1.3
tValues: 6.3V | 16V | 16V | 16V | 16V | 25V